# Altium project BCS1_REV2.2.PrjPcb (part 1 of 2)
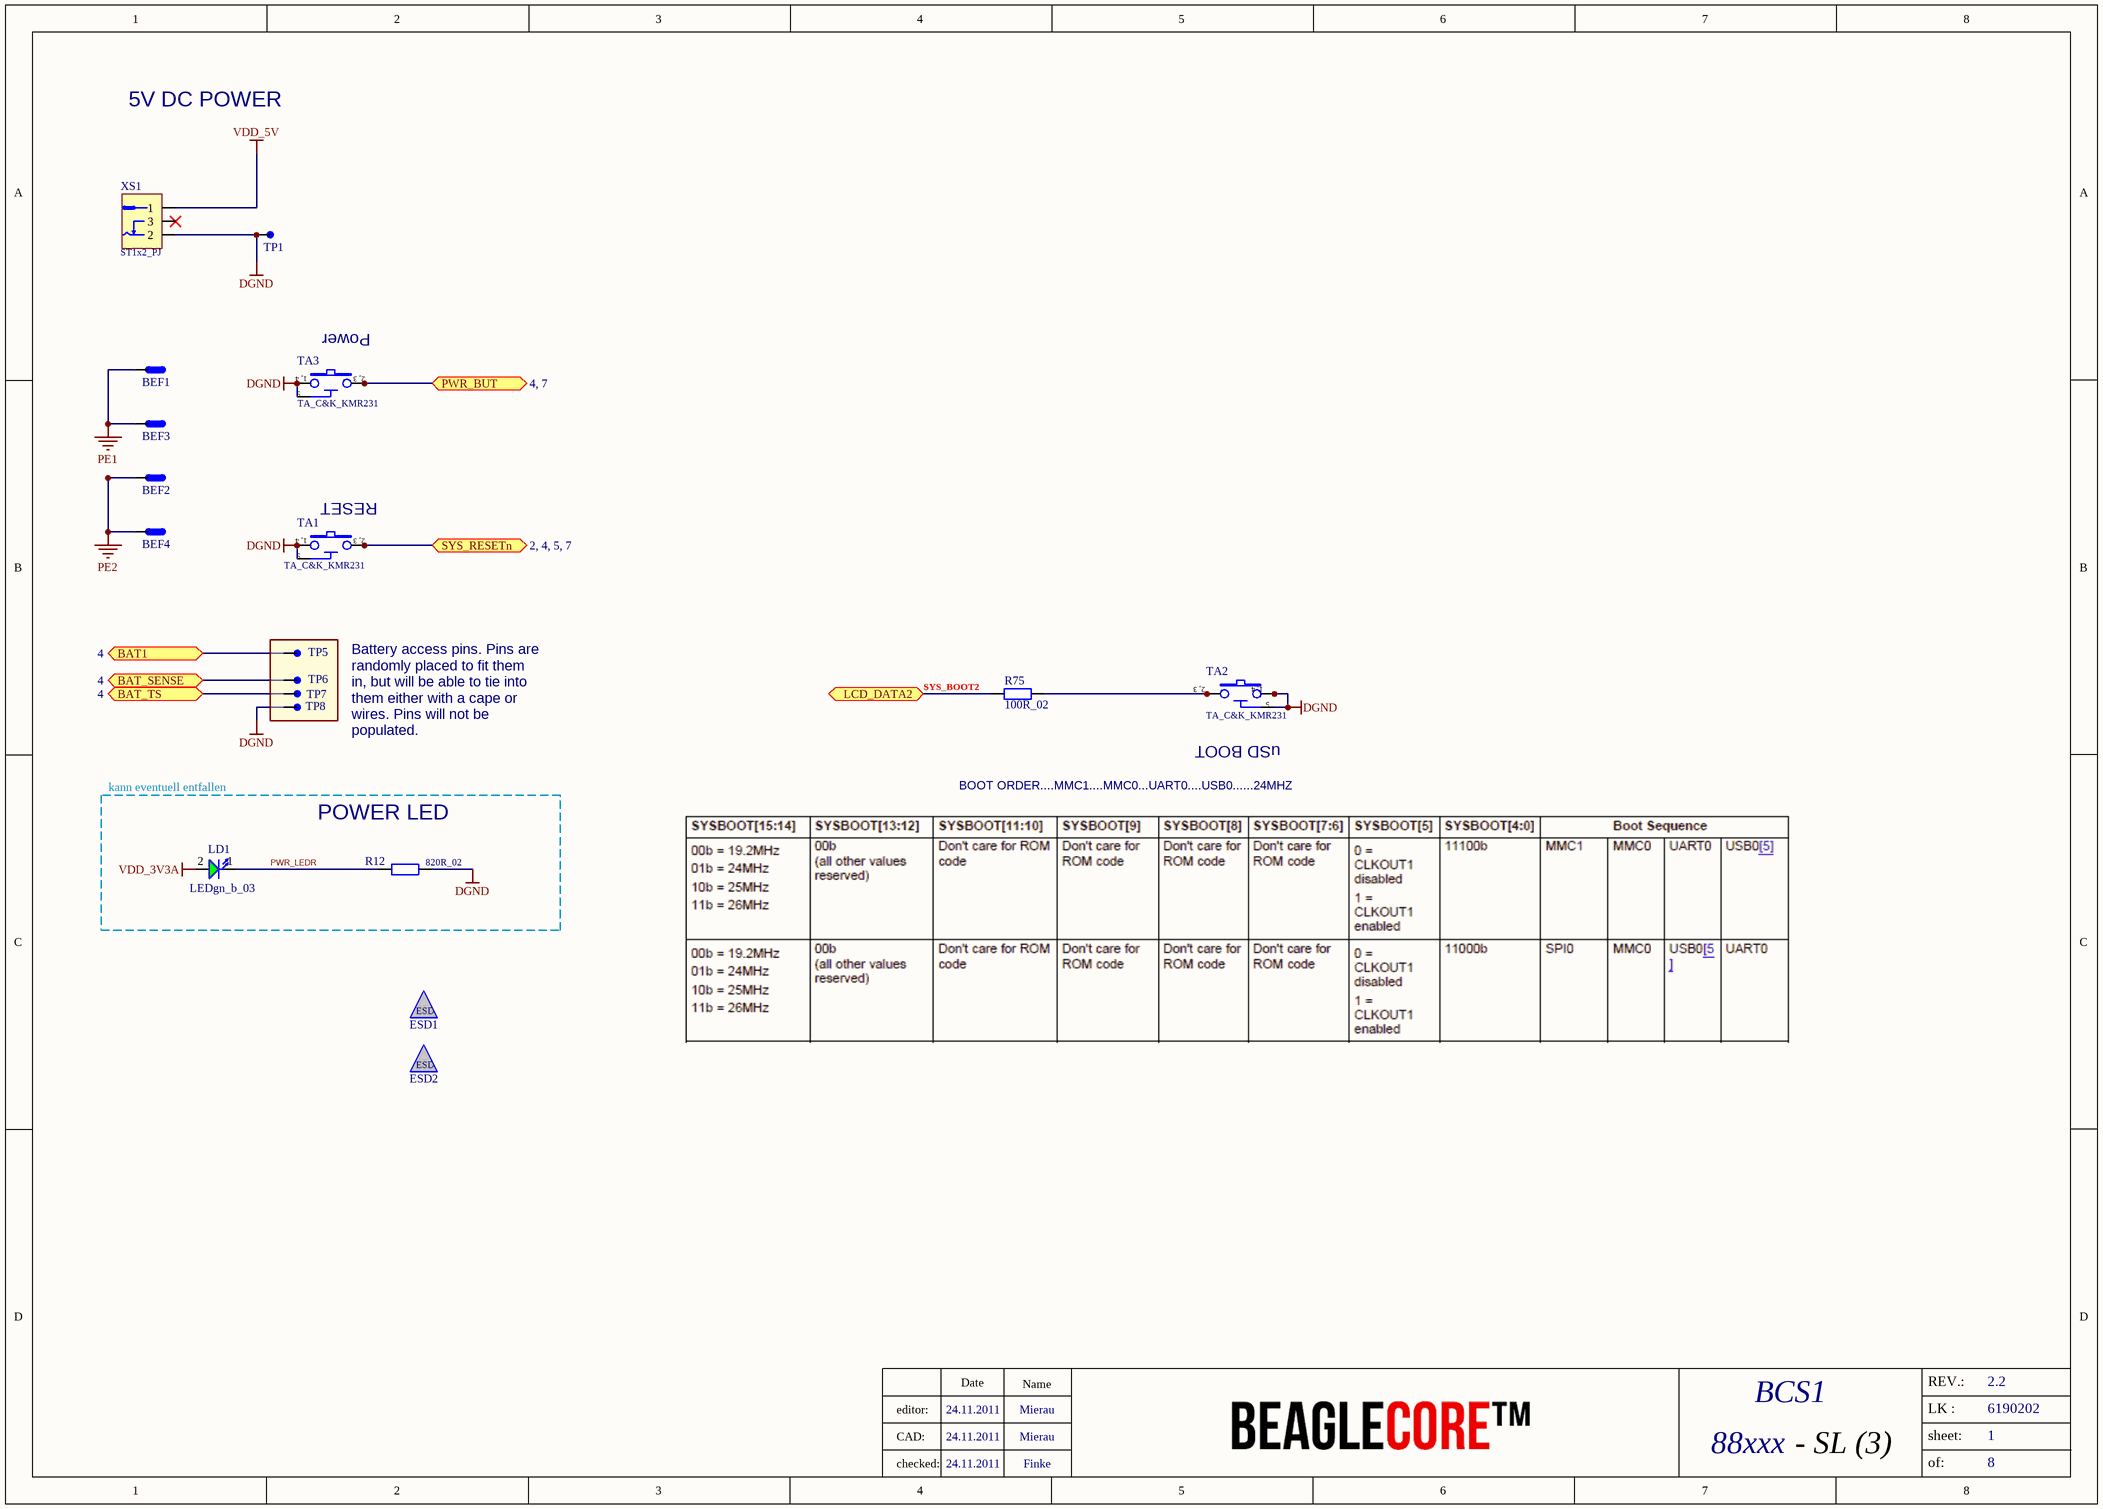
[diagram p0: P01_BCS1_Power BBCore.SchDoc]
IES_REV: 2.2; LKNummer: 6190202; ProjektName: BCS1; ProjektNummer: 88644
8 sheets, 201 parts. Net scope: global (net labels, ports and power ports of the same name join across sheets).
Board file: BCS1_REV2.2.PcbDoc
Sheets:
  P01_BCS1_Power BBCore.SchDoc
  P02_BCS1_JTAG, Clock, LED.SchDoc
  P03_BCS1_USB, Serial, uSD.SchDoc
  P04_BCS1_Core Connector.SchDoc
  P05_BCS1_Ethernet.SchDoc
  P06_BCS1_HDMI Framer.SchDoc
  P07_BCS1_Exp Conn.SchDoc
  P08_BCS1_Revision Page.SchDoc

## Sheet P01_BCS1_Power BBCore.SchDoc
size A3; Date: 24.11.2011; CheckedBy: Finke; Author: Mierau; DrawnBy: Mierau; SheetNumber: 1; SheetTotal: 8; Anlage: 78; Beschreibung: Qseven; Kunde: 56; ProjektName: BCS1; ProjektNummer: 88xxx; Ersatz_fuer: 12; ersetzt_durch: 34; LKNummer: 6190202; ID_Nummer: 90

### Parts
BEF1  BEF_3.2_4.45  [BEF_3.2_4.45]  (value not drawn)  (no BOM)
BEF2  BEF_3.2_4.45  [BEF_3.2_4.45]  (value not drawn)  (no BOM)
BEF3  BEF_3.2_4.45  [BEF_3.2_4.45]  (value not drawn)  (no BOM)
BEF4  BEF_3.2_4.45  [BEF_3.2_4.45]  (value not drawn)  (no BOM)
ESD1  ESD  [ESD_G]  (value not drawn)  (no BOM)
ESD2  ESD  [ESD_G]  (value not drawn)  (no BOM)
LD1  LEDgn_b_03  [CD1608-0603]
R12  820R_02  [CR1005-0402]
R75  100R_02  [CR1005-0402]
TA1  TA_C&K_KMR231  [TA_KMR2]
TA2  TA_C&K_KMR231  [TA_KMR2]
TA3  TA_C&K_KMR231  [TA_KMR2]
TP1  TP THT  [TP mit 0.8mm Bohrung]  (value not drawn)  (no BOM)
TP5  TP THT  [TP mit 0.8mm Bohrung]  (value not drawn)  (no BOM)
TP6  TP THT  [TP mit 0.8mm Bohrung]  (value not drawn)  (no BOM)
TP7  TP THT  [TP mit 0.8mm Bohrung]  (value not drawn)  (no BOM)
TP8  TP THT  [TP mit 0.8mm Bohrung]  (value not drawn)  (no BOM)
XS1  ST1x2_PJ  [ST1X2THT-2mm-DC_WA]

### Blocks framed on the sheet
POWER LED: LD1 R12

### Ports
BAT1 (see 4), BAT_SENSE (see 4), BAT_TS (see 4), LCD_DATA2, PWR_BUT (see 4, 7), SYS_RESETn (see 2, 4, 5, 7)

### Nets
DGND: R12.2 TA1.1 TA1.4 TA1.5 TA2.1 TA2.4 TA2.5 TA3.1 TA3.4 TA3.5 TP1.1(Pin) TP8.1(Pin) XS1.2
PE1: BEF1.1(Pin) BEF3.1(Pin)
PE2: BEF2.1(Pin) BEF4.1(Pin)
VDD_3V3A: LD1.2(A)
VDD_5V: XS1.1
BAT1: TP5.1(Pin) ; port BAT1
BAT_SENSE: TP6.1(Pin) ; port BAT_SENSE
BAT_TS: TP7.1(Pin) ; port BAT_TS
LCD_DATA2: R75.1 ; port LCD_DATA2
PWR_BUT: TA3.2 TA3.3 ; port PWR_BUT
PWR_LEDR: LD1.1(K) R12.1
SYS_RESETn: TA1.2 TA1.3 ; port SYS_RESETn
NetR75_2: R75.2 TA2.2 TA2.3

Not connected (* = marked no-connect by the designer): XS1 3*

### Notes on the sheet
- 5V DC POWER
- (near TA3) Power
- (near TA1) RESET
- (near R75) SYS_BOOT2
- Battery access pins. Pins are randomly placed to fit them in, but will be able to tie into them either with a cape or wires. Pins will not be populated.
- BOOT ORDER....MMC1....MMC0...UART0....USB0......24MHZ
- (near TA2) uSD BOOT
- kann eventuell entfallen
- Date
- Name
- REV.:
- editor:
- CAD:
- - SL (3)
- sheet:
- LK :
- checked:
- of:
- (in symbol TASTER_C&K_KMR231) 1, 4; 2, 3

### Library data of the parts
BEF1-BEF4 = A_BEF_3.2_4.45: Befestigungsbohrung D=3.2mm_4.45_Rand; Value: BEF_3.2_4.45
ESD1 ESD2 = A_ESD: ESD Symbol; Value: ESD
LD1 = LD_LEDgn_bright_03: Leuchtdiode bright grün 0603, RV(5mA)@3V3= 100OHM; Hersteller: Würth Elektronik; Bestellbezeichnung: 150060VS75000; Value: LEDgn_b_03
R12 = R820R_02: Resistor 0402; Value: 820R_02
R75 = R100R_02: Resistor 0402 1%; Value: 100R_02
TA1-TA3 = TASTER_C&K_KMR231: Taster smd 1pol mm pitch, 4.6x2.8mm case; Hersteller: C&K; Bestellbezeichnung: KMR231GLFS; Value: TA_C&K_KMR231
TP1 TP5-TP8 = TP1.6 mit Bohrung 0.8: Testpunkt rund mit Bohrung D=0.8mm; Value: TP THT
  TP5-TP8: Revision: *
XS1 = XST1X2_PJ_WA: DC-Power-Jack, 2mm Stift, 5A, THT,gew.; Hersteller: CUI; Bestellbezeichnung: PJ-002AH; Value: ST1x2_PJ

## Sheet P02_BCS1_JTAG, Clock, LED.SchDoc
size A3; Date: 24.11.2011; CheckedBy: Finke; Author: Mierau; DrawnBy: Mierau; SheetNumber: 2; SheetTotal: 8; Anlage: 78; Beschreibung: Qseven; Kunde: 56; ProjektName: BCS1; ProjektNummer: 88xxx; Ersatz_fuer: 12; ersetzt_durch: 34; LKNummer: 6190202; ID_Nummer: 90
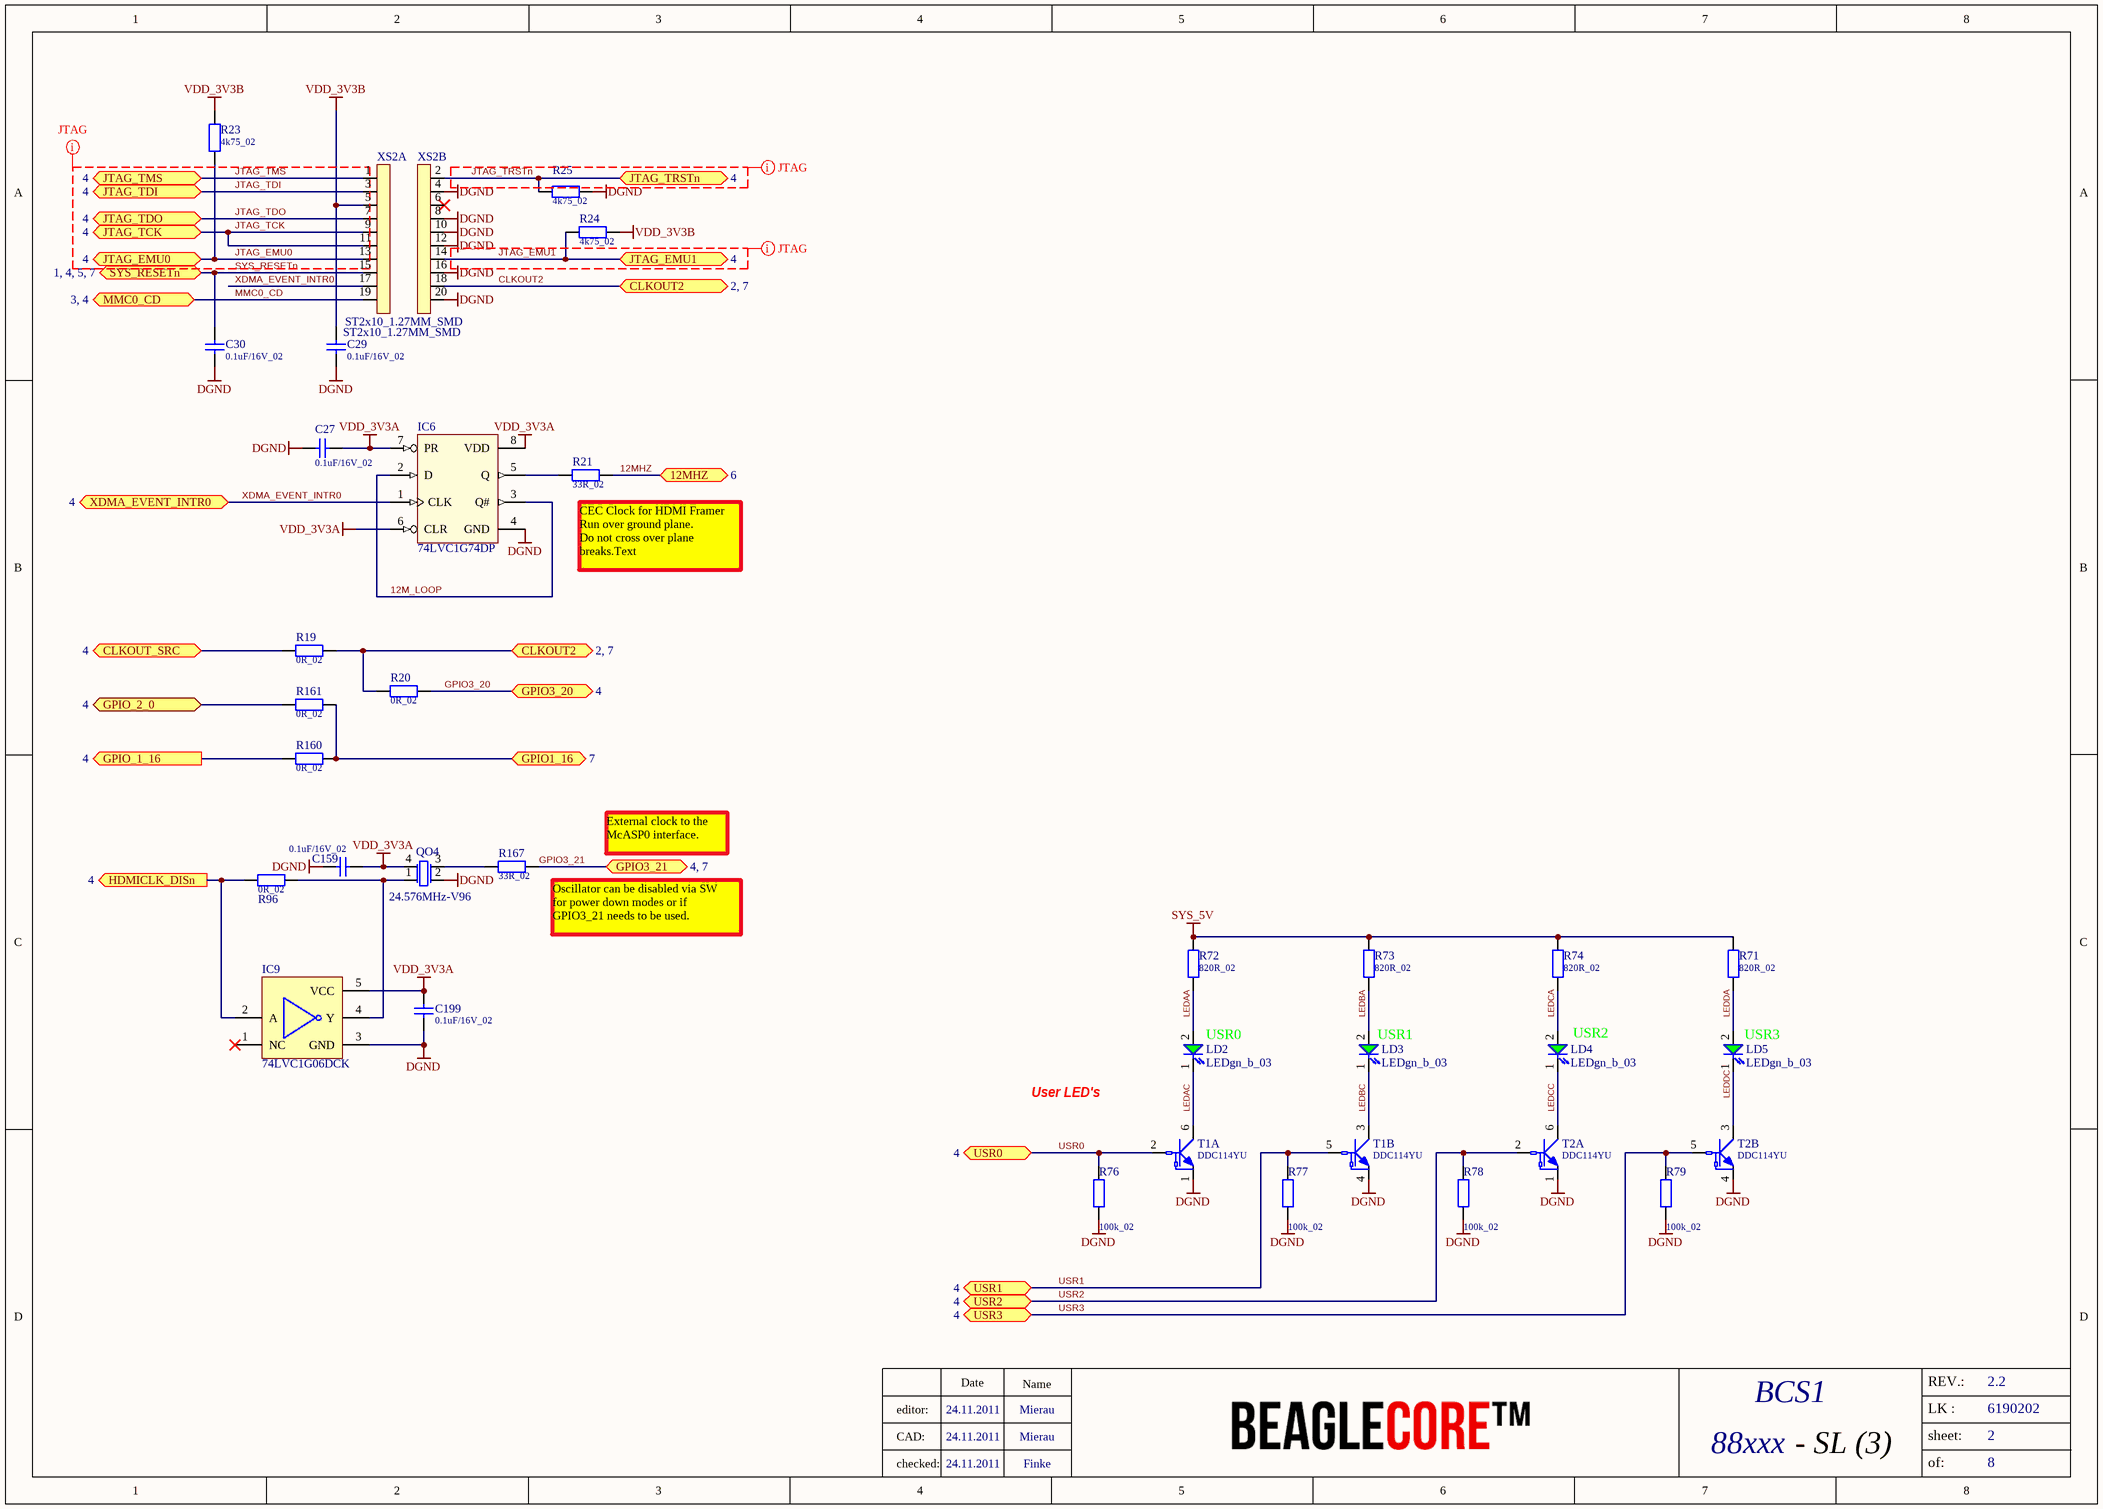
[diagram p1: P02_BCS1_JTAG, Clock, LED.SchDoc]

### Parts
C27  0.1uF/16V_02  [CC1005-0402]
C29  0.1uF/16V_02  [CC1005-0402]
C30  0.1uF/16V_02  [CC1005-0402]
C159  0.1uF/16V_02  [CC1005-0402]
C199  0.1uF/16V_02  [CC1005-0402]
IC6  74LVC1G74DP  [TSSOP8 - 3x3]
IC9  74LVC1G06DCK  [SOT353]
LD2  LEDgn_b_03  [CD1608-0603]
LD3  LEDgn_b_03  [CD1608-0603]
LD4  LEDgn_b_03  [CD1608-0603]
LD5  LEDgn_b_03  [CD1608-0603]
QO4  24.576MHz-V96  [QUARZ KXO-V96]
R19  0R_02  [CR1005-0402]
R20  0R_02  [CR1005-0402]
R21  33R_02  [CR1005-0402]
R23  4k75_02  [CR1005-0402]
R24  4k75_02  [CR1005-0402]
R25  4k75_02  [CR1005-0402]
R71  820R_02  [CR1005-0402]
R72  820R_02  [CR1005-0402]
R73  820R_02  [CR1005-0402]
R74  820R_02  [CR1005-0402]
R76  100k_02  [CR1005-0402]
R77  100k_02  [CR1005-0402]
R78  100k_02  [CR1005-0402]
R79  100k_02  [CR1005-0402]
R96  0R_02  [CR1005-0402]
R160  0R_02  [CR1005-0402]
R161  0R_02  [CR1005-0402]
R167  33R_02  [CR1005-0402]
T1  DDC114YU  [SOT363]  (parts A,B of 2)
T2  DDC114YU  [SOT363]  (parts A,B of 2)
XS2  ST2x10_1.27MM_SMD  [ST2X10SMD-1.27_SAMTEC]  (parts A,B of 2)

### Ports
12MHZ (see 6), CLKOUT2 (see 2, 7), CLKOUT_SRC (bidir, see 4), GPIO1_16 (see 7), GPIO3_20 (see 4), GPIO3_21 (see 4, 7), GPIO_1_16 (out, see 4), GPIO_2_0 (bidir, see 4), HDMICLK_DISn (out, see 4), JTAG_EMU0 (see 4), JTAG_EMU1 (see 4), JTAG_TCK (see 4), JTAG_TDI (see 4), JTAG_TDO (see 4), JTAG_TMS (see 4), JTAG_TRSTn (see 4), MMC0_CD (see 3, 4), SYS_RESETn (see 1, 4, 5, 7), USR0 (see 4), USR1 (see 4), USR2 (see 4), USR3 (see 4), XDMA_EVENT_INTR0 (bidir, see 4)

### Nets
DGND: C27.2 C29.1 C30.1 C159.1 C199.1 IC6.4(GND) IC9.3(GND) QO4.2(GND) R25.2 R76.1 R77.1 R78.1 R79.1 T1.1(EMITTER1) T1.4(EMITTER2) T2.1(EMITTER1) T2.4(EMITTER2) XS2.4 XS2.8 XS2.10 XS2.12 XS2.16 XS2.20
SYS_5V: R71.1 R72.1 R73.1 R74.1
VDD_3V3A: C27.1 C159.2 C199.2 IC6.6(CLR) IC6.7(PR) IC6.8(VDD) IC9.5(VCC) QO4.4(VDD)
VDD_3V3B: C29.2 R23.1 R24.1 XS2.5
12M_LOOP: IC6.2(D) IC6.3(Q#)
12MHZ: R21.2 ; port 12MHZ
CLKOUT2: R19.2 R20.1 XS2.18 ; port CLKOUT2
CLKOUT_SRC: R19.1 ; port CLKOUT_SRC
GPIO1_16: R160.2 R161.2 ; port GPIO1_16
GPIO3_20: R20.2 ; port GPIO3_20
GPIO3_21: R167.2 ; port GPIO3_21
GPIO_1_16: R160.1 ; port GPIO_1_16
GPIO_2_0: R161.1 ; port GPIO_2_0
HDMICLK_DISn: IC9.2(A) R96.1 ; port HDMICLK_DISn
JTAG_EMU0: R23.2 XS2.13 ; port JTAG_EMU0
JTAG_EMU1: R24.2 XS2.14 ; port JTAG_EMU1
JTAG_TCK: XS2.9 XS2.11 ; port JTAG_TCK
JTAG_TDI: XS2.3 ; port JTAG_TDI
JTAG_TDO: XS2.7 ; port JTAG_TDO
JTAG_TMS: XS2.1 ; port JTAG_TMS
JTAG_TRSTn: R25.1 XS2.2 ; port JTAG_TRSTn
LEDAA: LD2.2(A) R72.2
LEDAC: LD2.1(K) T1.6(COLLECTOR1)
LEDBA: LD3.2(A) R73.2
LEDBC: LD3.1(K) T1.3(COLLECTOR2)
LEDCA: LD4.2(A) R74.2
LEDCC: LD4.1(K) T2.6(COLLECTOR1)
LEDDA: LD5.2(A) R71.2
LEDDC: LD5.1(K) T2.3(COLLECTOR2)
MMC0_CD: XS2.19 ; port MMC0_CD
SYS_RESETn: C30.2 XS2.15 ; port SYS_RESETn
USR0: R76.2 T1.2(BASE1) ; port USR0
USR1: R77.2 T1.5(BASE2) ; port USR1
USR2: R78.2 T2.2(BASE1) ; port USR2
USR3: R79.2 T2.5(BASE2) ; port USR3
XDMA_EVENT_INTR0: IC6.1(CLK) XS2.17 ; port XDMA_EVENT_INTR0
NetIC6_5: IC6.5(Q) R21.1
NetIC9_4: IC9.4(Y) QO4.1(EN#) R96.2
NetQO4_3: QO4.3(OUTPUT) R167.1

Not connected (* = marked no-connect by the designer): IC9 1(NC)*; XS2 6*

### Layout directives
net class JTAG: JTAG_EMU0, JTAG_EMU1, JTAG_TCK, JTAG_TDI, JTAG_TDO, JTAG_TMS, JTAG_TRSTn

### Notes on the sheet
- (near R21) CEC Clock for HDMI Framer
  Run over ground plane.
  Do not cross over plane
  breaks.Text
- External clock to the
  McASP0 interface.
- (near R167) Oscillator can be disabled via SW
  for power down modes or if
  GPIO3_21 needs to be used.
- (near LD2) USR0
- (near LD3) USR1
- (near LD4) USR2
- (near LD5) USR3
- User LED's
- Date
- Name
- REV.:
- editor:
- CAD:
- - SL (3)
- sheet:
- LK :
- checked:
- of:

### Library data of the parts
C27 C29 C30 C159 C199 = C0.1uF/16V_02: Capacitor 0402 16V Y5V; Value: 0.1uF/16V_02
IC6 = IC74LVC1G74DP: Dual D-Type Positive-Edge-Triggered Flip-Flop with Set and Reset; Hersteller: NXP; Bestellbezeichnung: 74LVC1G74DP; Value: 74LVC1G74DP
IC9 = IC74LVC1G06DCK: Single Inverter Buffer/Driver With Open-Drain Output; Hersteller: TI; Bestellbezeichnung: 74LVC1G06DCK; Value: 74LVC1G06DCK
LD2-LD5 = LD_LEDgn_bright_03: as LD1 on sheet P01_BCS1_Power BBCore; Value: LEDgn_b_03
QO4 = QO24.576MHz_V96: Quarz Oszillator 24.576MHz; KXO-V96; Hersteller: Geyer; Bestellbezeichnung: KXO-V96 24.576MHz; Value: 24.576MHz-V96
R19 R20 R96 R160 R161 = R0R_02: Resistor 0402; Value: 0R_02
R21 R167 = R33R_02: Resistor 0402; Value: 33R_02
R23-R25 = R4k75_02: Resistor 0402; Value: 4k75_02
R71-R74 = R820R_02: Resistor 0402; Value: 820R_02
R76-R79 = R100k_02: Resistor 0402; Value: 100k_02
T1 T2 = TDDC114YU: 2 fach NPN m Widerständen Vceo=40V, Ic=0.1A; Hersteller: Rohm; Bestellbezeichnung: DDC114YU; Value: DDC114YU
XS2 = XST2X10_1.27MM_SMD_SAM: Stiftleiste 20polig, 1.27mm pitch, Samtec; Bestellbezeichnung: FTR-110-03-G-D-06; Hersteller: Samtec; Value: ST2x10_1.27MM_SMD

## Sheet P03_BCS1_USB, Serial, uSD.SchDoc
size A3; Date: 24.11.2011; CheckedBy: Finke; Author: Mierau; DrawnBy: Mierau; SheetNumber: 3; SheetTotal: 8; Anlage: 78; Beschreibung: Qseven; Kunde: 56; ProjektName: BCS1; ProjektNummer: 88xxx; Ersatz_fuer: 12; ersetzt_durch: 34; LKNummer: 6190202; ID_Nummer: 90
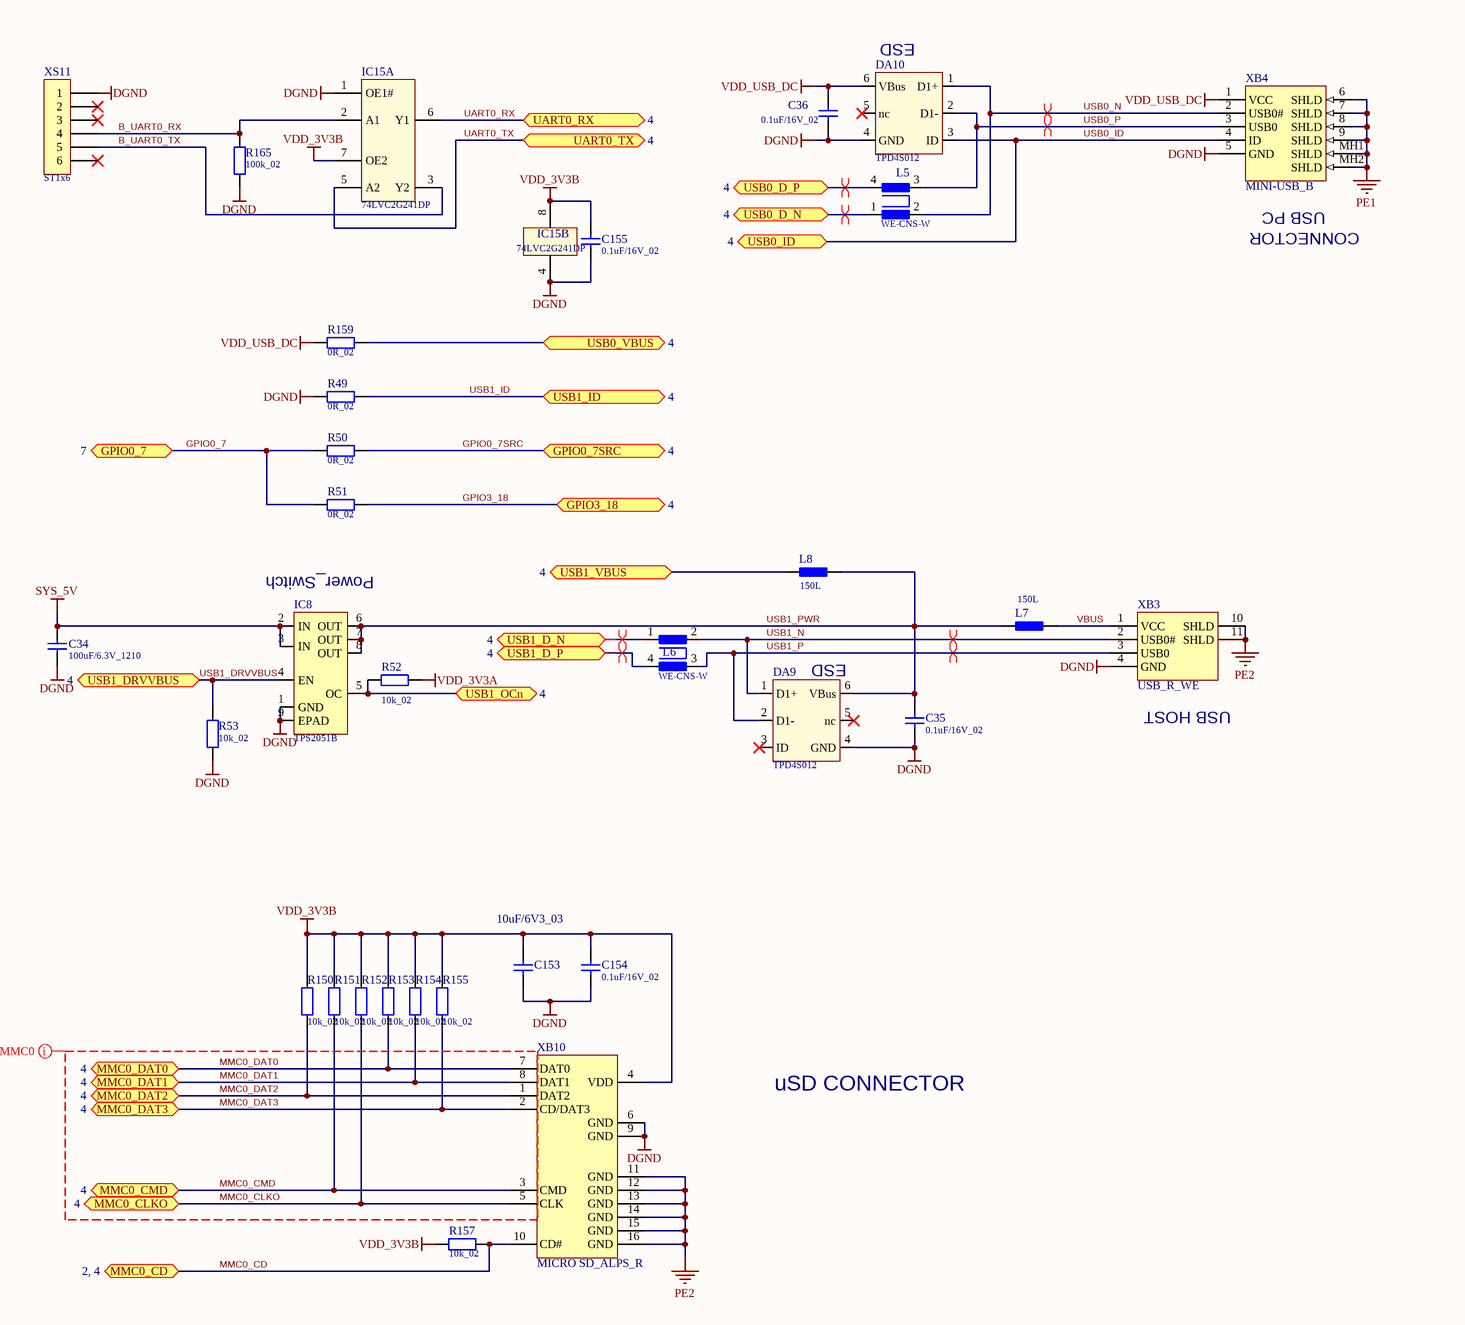
[diagram p2: P03_BCS1_USB, Serial, uSD.SchDoc]

### Parts
C34  100uF/6.3V_1210  [CC3225-1210]
C35  0.1uF/16V_02  [CC1005-0402]
C36  0.1uF/16V_02  [CC1005-0402]
C153  10uF/6V3_03  [CC1608-0603]
C154  0.1uF/16V_02  [CC1005-0402]
C155  0.1uF/16V_02  [CC1005-0402]
DA9  TPD4S012  [SON6]
DA10  TPD4S012  [SON6]
IC8  TPS2051B  [DGN-MSOP8+1]
IC15  74LVC2G241DP  [TSSOP8 - 3x3]  (parts A,B of 2)
L5  WE-CNS-W  [WE-CNS_W - 0805]
L6  WE-CNS-W  [WE-CNS_W - 0805]
L7  150L  [CR2012-0805]
L8  150L  [CR2012-0805]
R49  0R_02  [CR1005-0402]
R50  0R_02  [CR1005-0402]
R51  0R_02  [CR1005-0402]
R52  10k_02  [CR1005-0402]
R53  10k_02  [CR1005-0402]
R150  10k_02  [CR1005-0402]
R151  10k_02  [CR1005-0402]
R152  10k_02  [CR1005-0402]
R153  10k_02  [CR1005-0402]
R154  10k_02  [CR1005-0402]
R155  10k_02  [CR1005-0402]
R157  10k_02  [CR1005-0402]
R159  0R_02  [CR1005-0402]
R165  100k_02  [CR1005-0402]
XB3  USB_R_WE  [61400416021]
XB4  MINI-USB_B  [USB-MINI-B]
XB10  MICRO SD_ALPS_R  [Micro-SD-Card-Conn-ALPS- Reverse Mount]
XS11  ST1x6  [ST6]

### Ports
GPIO0_7 (see 7), GPIO0_7SRC (bidir, see 4), GPIO3_18 (bidir, see 4), MMC0_CD (see 2, 4), MMC0_CLKO (see 4), MMC0_CMD (see 4), MMC0_DAT0 (see 4), MMC0_DAT1 (see 4), MMC0_DAT2 (see 4), MMC0_DAT3 (see 4), UART0_RX (see 4), UART0_TX (see 4), USB0_D_N (bidir, see 4), USB0_D_P (bidir, see 4), USB0_ID (see 4), USB0_VBUS (see 4), USB1_D_N (bidir, see 4), USB1_D_P (bidir, see 4), USB1_DRVVBUS (see 4), USB1_ID (see 4), USB1_OCn (see 4), USB1_VBUS (see 4)

### Nets
DGND: C34.1 C35.2 C36.2 C153.1 C154.1 C155.2 DA9.4(GND) DA10.4(GND) IC8.1(GND) IC8.9(EPAD) IC15.1(OE1#) IC15.4(GND) R49.1 R53.1 R165.1 XB3.4(GND) XB4.5(GND) XB10.6(GND) XB10.9(GND) XS11.1
PE1: XB4.6(SHLD) XB4.7(SHLD) XB4.8(SHLD) XB4.9(SHLD) XB4.MH1(SHLD) XB4.MH2(SHLD)
PE2: XB3.10(SHLD) XB3.11(SHLD) XB10.11(GND) XB10.12(GND) XB10.13(GND) XB10.14(GND) XB10.15(GND) XB10.16(GND)
SYS_5V: C34.2 IC8.2(IN) IC8.3(IN)
VDD_3V3A: R52.2
VDD_3V3B: C153.2 C154.2 C155.1 IC15.7(OE2) IC15.8(VDD) R150.1 R151.1 R152.1 R153.1 R154.1 R155.1 R157.1 XB10.4(VDD)
VDD_USB_DC: C36.1 DA10.6(VBus) R159.1 XB4.1(VCC)
B_UART0_RX: IC15.2(A1) R165.2 XS11.4
B_UART0_TX: IC15.3(Y2) XS11.5
GPIO0_7: R50.1 R51.1 ; port GPIO0_7
GPIO0_7SRC: R50.2 ; port GPIO0_7SRC
GPIO3_18: R51.2 ; port GPIO3_18
MMC0_CD: R157.2 XB10.10(CD#) ; port MMC0_CD
MMC0_CLKO: R152.2 XB10.5(CLK) ; port MMC0_CLKO
MMC0_CMD: R151.2 XB10.3(CMD) ; port MMC0_CMD
MMC0_DAT0: R153.2 XB10.7(DAT0) ; port MMC0_DAT0
MMC0_DAT1: R154.2 XB10.8(DAT1) ; port MMC0_DAT1
MMC0_DAT2: R150.2 XB10.1(DAT2) ; port MMC0_DAT2
MMC0_DAT3: R155.2 XB10.2(CD/DAT3) ; port MMC0_DAT3
UART0_RX: IC15.6(Y1) ; port UART0_RX
UART0_TX: IC15.5(A2) ; port UART0_TX
USB0_D_N: L5.1 ; port USB0_D_N
USB0_D_P: L5.4 ; port USB0_D_P
USB0_ID: DA10.3(ID) XB4.4(ID) ; port USB0_ID
USB0_N: DA10.1(D1+) L5.2 XB4.2(USB0#)
USB0_P: DA10.2(D1-) L5.3 XB4.3(USB0)
USB0_VBUS: R159.2 ; port USB0_VBUS
USB1_D_N: L6.1 ; port USB1_D_N
USB1_D_P: L6.4 ; port USB1_D_P
USB1_DRVVBUS: IC8.4(EN) R53.2 ; port USB1_DRVVBUS
USB1_ID: R49.2 ; port USB1_ID
USB1_N: DA9.1(D1+) L6.2 XB3.2(USB0#)
USB1_OCn: IC8.5(OC) R52.1 ; port USB1_OCn
USB1_P: DA9.2(D1-) L6.3 XB3.3(USB0)
USB1_PWR: C35.1 DA9.6(VBus) IC8.6(OUT) IC8.7(OUT) IC8.8(OUT) L7.1 L8.2
USB1_VBUS: L8.1 ; port USB1_VBUS
VBUS: L7.2 XB3.1(VCC)

Not connected (* = marked no-connect by the designer): DA9 3(ID)* 5(nc)*; DA10 5(nc)*; XS11 2* 3* 6*

### Layout directives
differential pair: USB0_D_N, USB0_D_P, USB0_N, USB0_P, USB1_D_N, USB1_D_P, USB1_N, USB1_P
net class MMC0: MMC0_CLKO, MMC0_CMD, MMC0_DAT0, MMC0_DAT1, MMC0_DAT2, MMC0_DAT3

### Notes on the sheet
- (near DA10) ESD
- (near XB4) USB PC
- CONNECTOR
- (near IC8) Power_Switch
- (near DA9) ESD
- (near XB3) USB HOST
- uSD CONNECTOR
- Date
- Name
- REV.:
- editor:
- CAD:
- - SL (3)
- sheet:
- LK :
- checked:
- of:

### Library data of the parts
C34 = C100uF/6.3V_10: Capacitor 1210; 6.3V; Hersteller: Murata; Bestellbezeichnung: GRM32ER60J107ME20; Value: 100uF/6.3V_1210
C35 C36 C154 C155 = C0.1uF/16V_02: Capacitor 0402 16V Y5V; Value: 0.1uF/16V_02
C153 = C10uF/6V3_03: Capacitor 0603 6V3; 10%, X5R; Value: 10uF/6V3_03
DA9 DA10 = DATPD4S012: Diode Array TVS,  for USB2.0 TypB; 4fach; Hersteller: TI; Bestellbezeichnung: TPD4S012; Value: TPD4S012
IC8 = ICTPS2051B: Current-Limited PowerSwitch; Hersteller: ti; Bestellbezeichnung: TPS2051BDGNR; Value: TPS2051B
IC15 = IC74LVC2G241DP: dual buffer/line driver; 3-state, 5V-tolerant; Hersteller: NXP; Bestellbezeichnung: 74LVC2G241DP; Value: 74LVC2G241DP
L5 L6 = LWE-CNS FILTER: Stromkomp. Datenleitungsfilter WE-CNS-W, 90 Ohm; Hersteller: Würth Elektronik; Bestellbezeichnung: 744231091; Value: WE-CNS-W
L7 L8 = L150 Ohm Ferrite: Inductor 120 Ohm Ferrite 0805, 800mA; Hersteller: Laird-Signal Integrity Products; Bestellbezeichnung: LI0805H151R-10; Value: 150L
R49-R51 R159 = R0R_02: Resistor 0402; Value: 0R_02
R52 R53 R150-R155 R157 = R10k_02: Resistor 0402; Value: 10k_02
R165 = R100k_02: Resistor 0402; Value: 100k_02
XB3 = XBUSB_R_WE: USB einfach RA Type A; Hersteller: Würth; Bestellbezeichnung: 61400416021; Value: USB_R_WE
XB4 = XBUSB_Mini-B: USB MINI Typ B einfach 5pol.; Hersteller: Molex; Bestellbezeichnung: 0513870530; Value: MINI-USB_B
XB10 = XBMICRO_SD_ALPS_R: MICRO SD Memory card connector push/push  reverse mount ALPS (SCHA5B0200); Hersteller: ALPS; Bestellbezeichnung: SCHA5B0200; Value: MICRO SD_ALPS_R
XS11 = XST1X6: Modul-Stiftleiste 2.54mm pitch einreihig, 6pol.; Value: ST1x6

## Sheet P04_BCS1_Core Connector.SchDoc
size A3; Date: 24.11.2011; CheckedBy: Finke; Author: Mierau; DrawnBy: Mierau; SheetNumber: 4; SheetTotal: 8; Anlage: 78; Beschreibung: Qseven; Kunde: 56; ProjektName: BCS1; ProjektNummer: 88xxx; Ersatz_fuer: 12; ersetzt_durch: 34; LKNummer: 6190202; ID_Nummer: 90
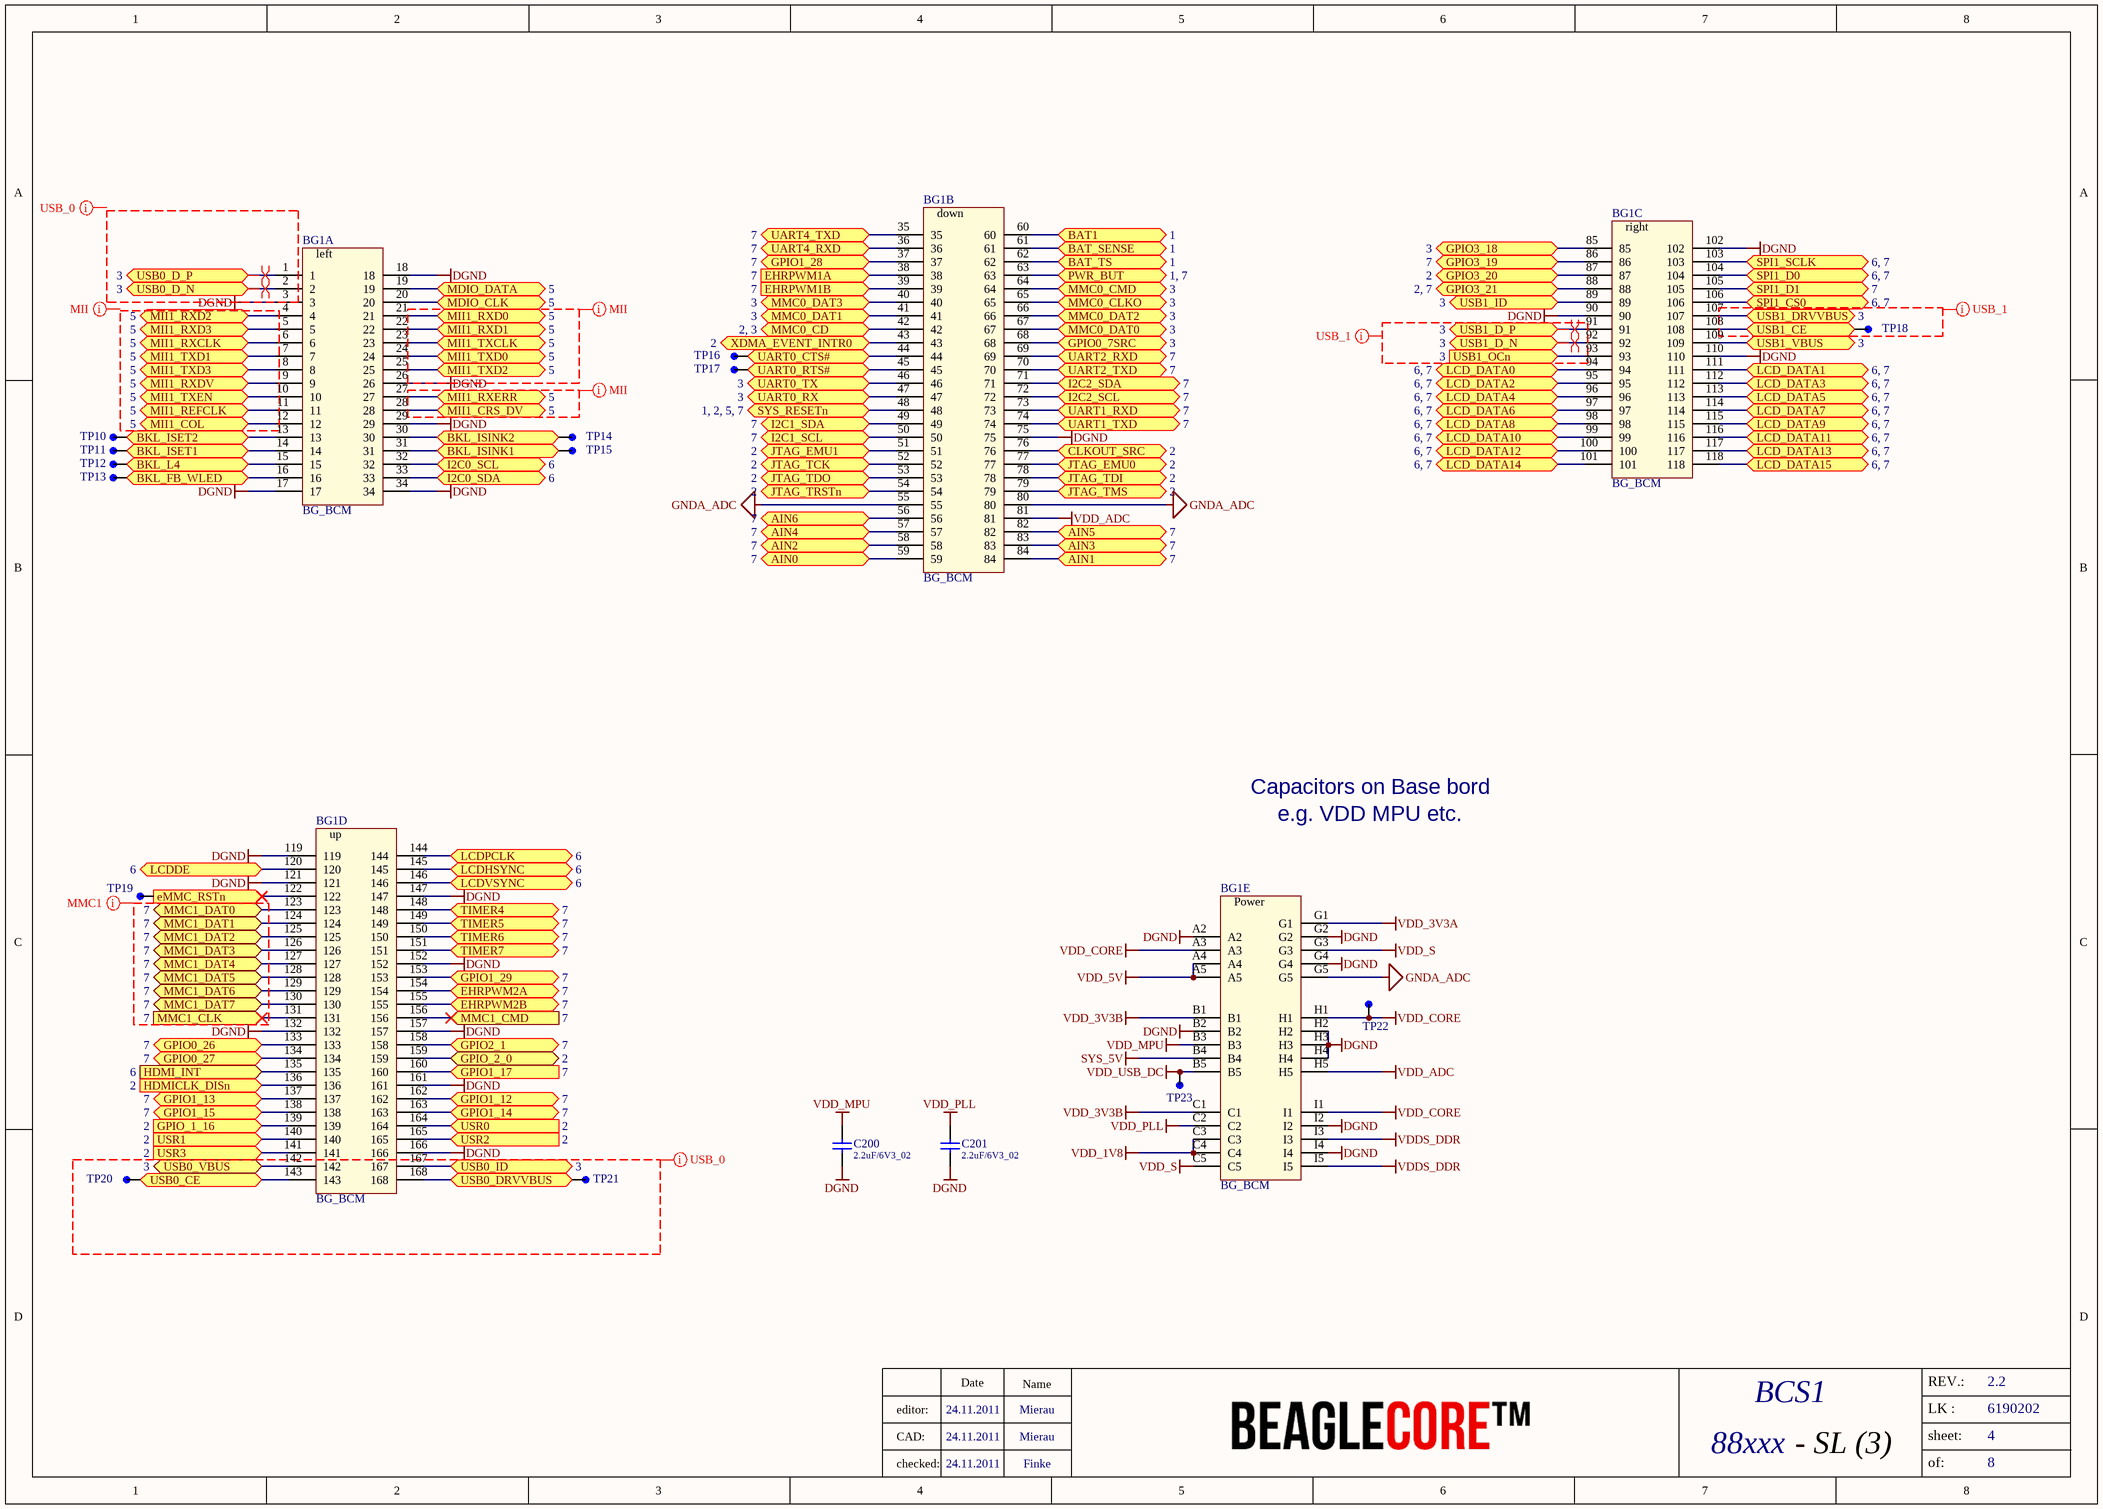
[diagram p3: P04_BCS1_Core Connector.SchDoc]

### Parts
BG1  BG_BCM  [BG_BCM]  (parts A,B,C,D,E of 5)  (no BOM)
C200  2.2uF/6V3_02  [CC1005-0402]
C201  2.2uF/6V3_02  [CC1005-0402]
TP10  TP THT  [TP mit 0.8mm Bohrung]  (value not drawn)  (no BOM)
TP11  TP THT  [TP mit 0.8mm Bohrung]  (value not drawn)  (no BOM)
TP12  TP THT  [TP mit 0.8mm Bohrung]  (value not drawn)  (no BOM)
TP13  TP THT  [TP mit 0.8mm Bohrung]  (value not drawn)  (no BOM)
TP14  TP THT  [TP mit 0.8mm Bohrung]  (value not drawn)  (no BOM)
TP15  TP THT  [TP mit 0.8mm Bohrung]  (value not drawn)  (no BOM)
TP16  TP THT  [TP mit 0.8mm Bohrung]  (value not drawn)  (no BOM)
TP17  TP THT  [TP mit 0.8mm Bohrung]  (value not drawn)  (no BOM)
TP18  TP THT  [TP mit 0.8mm Bohrung]  (value not drawn)  (no BOM)
TP19  TP THT  [TP mit 0.8mm Bohrung]  (value not drawn)  (no BOM)
TP20  TP THT  [TP mit 0.8mm Bohrung]  (value not drawn)  (no BOM)
TP21  TP THT  [TP mit 0.8mm Bohrung]  (value not drawn)  (no BOM)
TP22  TP THT  [TP mit 0.8mm Bohrung]  (value not drawn)  (no BOM)
TP23  TP THT  [TP mit 0.8mm Bohrung]  (value not drawn)  (no BOM)

### Ports
AIN0 (see 7), AIN1 (see 7), AIN2 (see 7), AIN3 (see 7), AIN4 (see 7), AIN5 (see 7), AIN6 (see 7), BAT1 (see 1), BAT_SENSE (see 1), BAT_TS (see 1), BKL_FB_WLED (bidir), BKL_ISET1 (bidir), BKL_ISET2 (bidir), BKL_ISINK1 (bidir), BKL_ISINK2 (bidir), BKL_L4 (bidir), CLKOUT_SRC (bidir, see 2), EHRPWM1A (in, see 7), EHRPWM1B (in, see 7), EHRPWM2A (bidir, see 7), EHRPWM2B (bidir, see 7), eMMC_RSTn (in), GPIO0_7SRC (bidir, see 3), GPIO0_26 (bidir, see 7), GPIO0_27 (bidir, see 7), GPIO1_12 (bidir, see 7), GPIO1_13 (bidir, see 7), GPIO1_14 (bidir, see 7), GPIO1_15 (bidir, see 7), GPIO1_17 (in, see 7), GPIO1_28 (bidir, see 7), GPIO1_29 (bidir, see 7), GPIO2_1 (bidir, see 7), GPIO3_18 (bidir, see 3), GPIO3_19 (bidir, see 7), GPIO3_20 (bidir, see 2), GPIO3_21 (bidir, see 2, 7), GPIO_1_16 (in, see 2), GPIO_2_0 (bidir, see 2), HDMI_INT (in, see 6), HDMICLK_DISn (in, see 2), I2C0_SCL (bidir, see 6), I2C0_SDA (bidir, see 6), I2C1_SCL (bidir, see 7), I2C1_SDA (bidir, see 7), I2C2_SCL (bidir, see 7), I2C2_SDA (bidir, see 7), JTAG_EMU0 (see 2), JTAG_EMU1 (see 2), JTAG_TCK (see 2), JTAG_TDI (see 2), JTAG_TDO (see 2), JTAG_TMS (see 2), JTAG_TRSTn (see 2), LCD_DATA0 (bidir, see 6, 7), LCD_DATA1 (bidir, see 6, 7), LCD_DATA2 (bidir, see 6, 7), LCD_DATA3 (bidir, see 6, 7), LCD_DATA4 (bidir, see 6, 7), LCD_DATA5 (bidir, see 6, 7), LCD_DATA6 (bidir, see 6, 7), LCD_DATA7 (bidir, see 6, 7), LCD_DATA8 (bidir, see 6, 7), LCD_DATA9 (bidir, see 6, 7), LCD_DATA10 (bidir, see 6, 7), LCD_DATA11 (bidir, see 6, 7), LCD_DATA12 (bidir, see 6, 7), LCD_DATA13 (bidir, see 6, 7), LCD_DATA14 (bidir, see 6, 7), LCD_DATA15 (bidir, see 6, 7), LCDDE (bidir, see 6), LCDHSYNC (bidir, see 6), LCDPCLK (bidir, see 6), LCDVSYNC (bidir, see 6), MDIO_CLK (bidir, see 5), MDIO_DATA (bidir, see 5), MII1_COL (bidir, see 5), MII1_CRS_DV (bidir, see 5), MII1_REFCLK (bidir, see 5), MII1_RXCLK (bidir, see 5), MII1_RXD0 (bidir, see 5), MII1_RXD1 (bidir, see 5), MII1_RXD2 (bidir, see 5), MII1_RXD3 (bidir, see 5), MII1_RXDV (bidir, see 5), MII1_RXERR (bidir, see 5), MII1_TXCLK (bidir, see 5), MII1_TXD0 (bidir, see 5), MII1_TXD1 (bidir, see 5), MII1_TXD2 (bidir, see 5), MII1_TXD3 (bidir, see 5), MII1_TXEN (bidir, see 5), MMC0_CD (bidir, see 2, 3), MMC0_CLKO (bidir, see 3), MMC0_CMD (bidir, see 3), MMC0_DAT0 (bidir, see 3), MMC0_DAT1 (bidir, see 3), MMC0_DAT2 (bidir, see 3), MMC0_DAT3 (bidir, see 3), MMC1_CLK (in, see 7), MMC1_CMD (in, see 7), MMC1_DAT0 (bidir, see 7), MMC1_DAT1 (bidir, see 7), MMC1_DAT2 (bidir, see 7), MMC1_DAT3 (bidir, see 7), MMC1_DAT4 (bidir, see 7), MMC1_DAT5 (bidir, see 7), MMC1_DAT6 (bidir, see 7), MMC1_DAT7 (bidir, see 7), PWR_BUT (see 1, 7), SPI1_CS0 (bidir, see 6, 7), SPI1_D0 (bidir, see 6, 7), SPI1_D1 (bidir, see 7), SPI1_SCLK (bidir, see 6, 7), SYS_RESETn (bidir, see 1, 2, 5, 7), TIMER4 (bidir, see 7), TIMER5 (bidir, see 7), TIMER6 (bidir, see 7), TIMER7 (bidir, see 7), UART0_CTS# (bidir), UART0_RTS# (bidir), UART0_RX (see 3), UART0_TX (bidir, see 3), UART1_RXD (bidir, see 7), UART1_TXD (bidir, see 7), UART2_RXD (bidir, see 7), UART2_TXD (bidir, see 7), UART4_RXD (bidir, see 7), UART4_TXD (see 7), USB0_CE, USB0_D_N (bidir, see 3), USB0_D_P (bidir, see 3), USB0_DRVVBUS, USB0_ID (see 3), USB0_VBUS (see 3), USB1_CE, USB1_D_N (bidir, see 3), USB1_D_P (bidir, see 3), USB1_DRVVBUS (see 3), USB1_ID (see 3), USB1_OCn (in, see 3), USB1_VBUS (see 3), USR0 (in, see 2), USR1 (in, see 2), USR2 (in, see 2), USR3 (in, see 2), XDMA_EVENT_INTR0 (bidir, see 2)

### Nets
DGND: BG1.3 BG1.17 BG1.18 BG1.26 BG1.29 BG1.34 BG1.75 BG1.90 BG1.102 BG1.110 BG1.119 BG1.121 BG1.132 BG1.147 BG1.152 BG1.157 BG1.161 BG1.166 BG1.A2 BG1.B2 BG1.G2 BG1.G4 BG1.H2 BG1.H3 BG1.H4 BG1.I2 BG1.I4 C200.1 C201.1
GNDA_ADC: BG1.55 BG1.80 BG1.G5
SYS_5V: BG1.B4
VDD_1V8: BG1.C3 BG1.C4
VDD_3V3A: BG1.G1
VDD_3V3B: BG1.B1 BG1.C1
VDD_5V: BG1.A4 BG1.A5
VDD_ADC: BG1.81 BG1.H5
VDD_CORE: BG1.A3 BG1.H1 BG1.I1 TP22.1(Pin)
VDD_MPU: BG1.B3 C200.2
VDD_PLL: BG1.C2 C201.2
VDD_S: BG1.C5 BG1.G3
VDD_USB_DC: BG1.B5 TP23.1(Pin)
VDDS_DDR: BG1.I3 BG1.I5
AIN0: BG1.59 ; port AIN0
AIN1: BG1.84 ; port AIN1
AIN2: BG1.58 ; port AIN2
AIN3: BG1.83 ; port AIN3
AIN4: BG1.57 ; port AIN4
AIN5: BG1.82 ; port AIN5
AIN6: BG1.56 ; port AIN6
BAT1: BG1.60 ; port BAT1
BAT_SENSE: BG1.61 ; port BAT_SENSE
BAT_TS: BG1.62 ; port BAT_TS
BKL_FB_WLED: BG1.16 TP13.1(Pin) ; port BKL_FB_WLED
BKL_ISET1: BG1.14 TP11.1(Pin) ; port BKL_ISET1
BKL_ISET2: BG1.13 TP10.1(Pin) ; port BKL_ISET2
BKL_ISINK1: BG1.31 TP15.1(Pin) ; port BKL_ISINK1
BKL_ISINK2: BG1.30 TP14.1(Pin) ; port BKL_ISINK2
BKL_L4: BG1.15 TP12.1(Pin) ; port BKL_L4
CLKOUT_SRC: BG1.76 ; port CLKOUT_SRC
EHRPWM1A: BG1.38 ; port EHRPWM1A
EHRPWM1B: BG1.39 ; port EHRPWM1B
EHRPWM2A: BG1.154 ; port EHRPWM2A
EHRPWM2B: BG1.155 ; port EHRPWM2B
eMMC_RSTn: BG1.122 TP19.1(Pin) ; port eMMC_RSTn
GPIO0_7SRC: BG1.68 ; port GPIO0_7SRC
GPIO0_26: BG1.133 ; port GPIO0_26
GPIO0_27: BG1.134 ; port GPIO0_27
GPIO1_12: BG1.162 ; port GPIO1_12
GPIO1_13: BG1.137 ; port GPIO1_13
GPIO1_14: BG1.163 ; port GPIO1_14
GPIO1_15: BG1.138 ; port GPIO1_15
GPIO1_17: BG1.160 ; port GPIO1_17
GPIO1_28: BG1.37 ; port GPIO1_28
GPIO1_29: BG1.153 ; port GPIO1_29
GPIO2_1: BG1.158 ; port GPIO2_1
GPIO3_18: BG1.85 ; port GPIO3_18
GPIO3_19: BG1.86 ; port GPIO3_19
GPIO3_20: BG1.87 ; port GPIO3_20
GPIO3_21: BG1.88 ; port GPIO3_21
GPIO_1_16: BG1.139 ; port GPIO_1_16
GPIO_2_0: BG1.159 ; port GPIO_2_0
HDMI_INT: BG1.135 ; port HDMI_INT
HDMICLK_DISn: BG1.136 ; port HDMICLK_DISn
I2C0_SCL: BG1.32 ; port I2C0_SCL
I2C0_SDA: BG1.33 ; port I2C0_SDA
I2C1_SCL: BG1.50 ; port I2C1_SCL
I2C1_SDA: BG1.49 ; port I2C1_SDA
I2C2_SCL: BG1.72 ; port I2C2_SCL
I2C2_SDA: BG1.71 ; port I2C2_SDA
JTAG_EMU0: BG1.77 ; port JTAG_EMU0
JTAG_EMU1: BG1.51 ; port JTAG_EMU1
JTAG_TCK: BG1.52 ; port JTAG_TCK
JTAG_TDI: BG1.78 ; port JTAG_TDI
JTAG_TDO: BG1.53 ; port JTAG_TDO
JTAG_TMS: BG1.79 ; port JTAG_TMS
JTAG_TRSTn: BG1.54 ; port JTAG_TRSTn
LCD_DATA0: BG1.94 ; port LCD_DATA0
LCD_DATA1: BG1.111 ; port LCD_DATA1
LCD_DATA2: BG1.95 ; port LCD_DATA2
LCD_DATA3: BG1.112 ; port LCD_DATA3
LCD_DATA4: BG1.96 ; port LCD_DATA4
LCD_DATA5: BG1.113 ; port LCD_DATA5
LCD_DATA6: BG1.97 ; port LCD_DATA6
LCD_DATA7: BG1.114 ; port LCD_DATA7
LCD_DATA8: BG1.98 ; port LCD_DATA8
LCD_DATA9: BG1.115 ; port LCD_DATA9
LCD_DATA10: BG1.99 ; port LCD_DATA10
LCD_DATA11: BG1.116 ; port LCD_DATA11
LCD_DATA12: BG1.100 ; port LCD_DATA12
LCD_DATA13: BG1.117 ; port LCD_DATA13
LCD_DATA14: BG1.101 ; port LCD_DATA14
LCD_DATA15: BG1.118 ; port LCD_DATA15
LCDDE: BG1.120 ; port LCDDE
LCDPCLK: BG1.144 ; port LCDPCLK
LCDVHYNC: BG1.145 ; port LCDHSYNC
LCDVSYNC: BG1.146 ; port LCDVSYNC
MDIO_CLK: BG1.20 ; port MDIO_CLK
MDIO_DATA: BG1.19 ; port MDIO_DATA
MII1_COL: BG1.12 ; port MII1_COL
MII1_CRS_DV: BG1.28 ; port MII1_CRS_DV
MII1_REFCLK: BG1.11 ; port MII1_REFCLK
MII1_RXCLK: BG1.6 ; port MII1_RXCLK
MII1_RXD0: BG1.21 ; port MII1_RXD0
MII1_RXD1: BG1.22 ; port MII1_RXD1
MII1_RXD2: BG1.4 ; port MII1_RXD2
MII1_RXD3: BG1.5 ; port MII1_RXD3
MII1_RXDV: BG1.9 ; port MII1_RXDV
MII1_RXERR: BG1.27 ; port MII1_RXERR
MII1_TXCLK: BG1.23 ; port MII1_TXCLK
MII1_TXD0: BG1.24 ; port MII1_TXD0
MII1_TXD1: BG1.7 ; port MII1_TXD1
MII1_TXD2: BG1.25 ; port MII1_TXD2
MII1_TXD3: BG1.8 ; port MII1_TXD3
MII1_TXEN: BG1.10 ; port MII1_TXEN
MMC0_CD: BG1.42 ; port MMC0_CD
MMC0_CLKO: BG1.65 ; port MMC0_CLKO
MMC0_CMD: BG1.64 ; port MMC0_CMD
MMC0_DAT0: BG1.67 ; port MMC0_DAT0
MMC0_DAT1: BG1.41 ; port MMC0_DAT1
MMC0_DAT2: BG1.66 ; port MMC0_DAT2
MMC0_DAT3: BG1.40 ; port MMC0_DAT3
MMC1_CLK: BG1.131 ; port MMC1_CLK
MMC1_CMD: BG1.156 ; port MMC1_CMD
MMC1_DAT0: BG1.123 ; port MMC1_DAT0
MMC1_DAT1: BG1.124 ; port MMC1_DAT1
MMC1_DAT2: BG1.125 ; port MMC1_DAT2
MMC1_DAT3: BG1.126 ; port MMC1_DAT3
MMC1_DAT4: BG1.127 ; port MMC1_DAT4
MMC1_DAT5: BG1.128 ; port MMC1_DAT5
MMC1_DAT6: BG1.129 ; port MMC1_DAT6
MMC1_DAT7: BG1.130 ; port MMC1_DAT7
PWR_BUT: BG1.63 ; port PWR_BUT
SPI1_CS0: BG1.106 ; port SPI1_CS0
SPI1_D0: BG1.104 ; port SPI1_D0
SPI1_D1: BG1.105 ; port SPI1_D1
SPI1_SCLK: BG1.103 ; port SPI1_SCLK
SYS_RESETn: BG1.48 ; port SYS_RESETn
TIMER4: BG1.148 ; port TIMER4
TIMER5: BG1.149 ; port TIMER5
TIMER6: BG1.150 ; port TIMER6
TIMER7: BG1.151 ; port TIMER7
UART0_CTS#: BG1.44 TP16.1(Pin) ; port UART0_CTS#
UART0_RTS#: BG1.45 TP17.1(Pin) ; port UART0_RTS#
UART0_RX: BG1.47 ; port UART0_RX
UART0_TX: BG1.46 ; port UART0_TX
UART1_RXD: BG1.73 ; port UART1_RXD
UART1_TXD: BG1.74 ; port UART1_TXD
UART2_RXD: BG1.69 ; port UART2_RXD
UART2_TXD: BG1.70 ; port UART2_TXD
UART4_RXD: BG1.36 ; port UART4_RXD
UART4_TXD: BG1.35 ; port UART4_TXD
USB0_CE: BG1.143 TP20.1(Pin) ; port USB0_CE
USB0_D_N: BG1.2 ; port USB0_D_N
USB0_D_P: BG1.1 ; port USB0_D_P
USB0_DRVVBUS: BG1.168 TP21.1(Pin) ; port USB0_DRVVBUS
USB0_ID: BG1.167 ; port USB0_ID
USB0_VBUS: BG1.142 ; port USB0_VBUS
USB1_CE: BG1.108 TP18.1(Pin) ; port USB1_CE
USB1_D_N: BG1.92 ; port USB1_D_N
USB1_D_P: BG1.91 ; port USB1_D_P
USB1_DRVVBUS: BG1.107 ; port USB1_DRVVBUS
USB1_ID: BG1.89 ; port USB1_ID
USB1_OCn: BG1.93 ; port USB1_OCn
USB1_VBUS: BG1.109 ; port USB1_VBUS
USR0: BG1.164 ; port USR0
USR1: BG1.140 ; port USR1
USR2: BG1.165 ; port USR2
USR3: BG1.141 ; port USR3
XDMA_EVENT_INTR0: BG1.43 ; port XDMA_EVENT_INTR0

### Layout directives
differential pair: USB0_D_N, USB0_D_P, USB1_D_N, USB1_D_P
net class MMC1: (no net found under the mark)
net class USB_0: (no net found under the mark)
net class USB_1: (no net found under the mark)
net class MII: (no net found under the mark), DGND

### Notes on the sheet
- Capacitors on Base bord
- e.g. VDD MPU etc.
- Date
- Name
- REV.:
- editor:
- CAD:
- - SL (3)
- sheet:
- LK :
- checked:
- of:
- (in symbol BG_BCM, part A) left
- (in symbol BG_BCM, part B) down
- (in symbol BG_BCM, part C) right
- (in symbol BG_BCM, part D) up
- (in symbol BG_BCM, part E) Power

### Library data of the parts
BG1 = BG_BCM: Beaglecore; Value: BG_BCM
C200 C201 = C2.2uF/6V3_02: Capacitor 0402;  6V3;  X5R; Value: 2.2uF/6V3_02
TP10-TP18 TP20-TP23 = TP1.6 mit Bohrung 0.8: Testpunkt rund mit Bohrung D=0.8mm; Value: TP THT
TP19 = TP1.6 mit Bohrung 0.8: Testpunkt rund mit Bohrung D=0.8mm; S/T: mech; erstellt von: Finke; Published: 24-Mar-1999; Art Nr.: *; Value: TP THT

## Sheet P05_BCS1_Ethernet.SchDoc
size A3; Date: 24.11.2011; CheckedBy: Finke; Author: Mierau; DrawnBy: Mierau; SheetNumber: 5; SheetTotal: 8; Anlage: 78; Beschreibung: Qseven; Kunde: 56; ProjektName: BCS1; ProjektNummer: 88xxx; Ersatz_fuer: 12; ersetzt_durch: 34; LKNummer: 6190202; ID_Nummer: 90
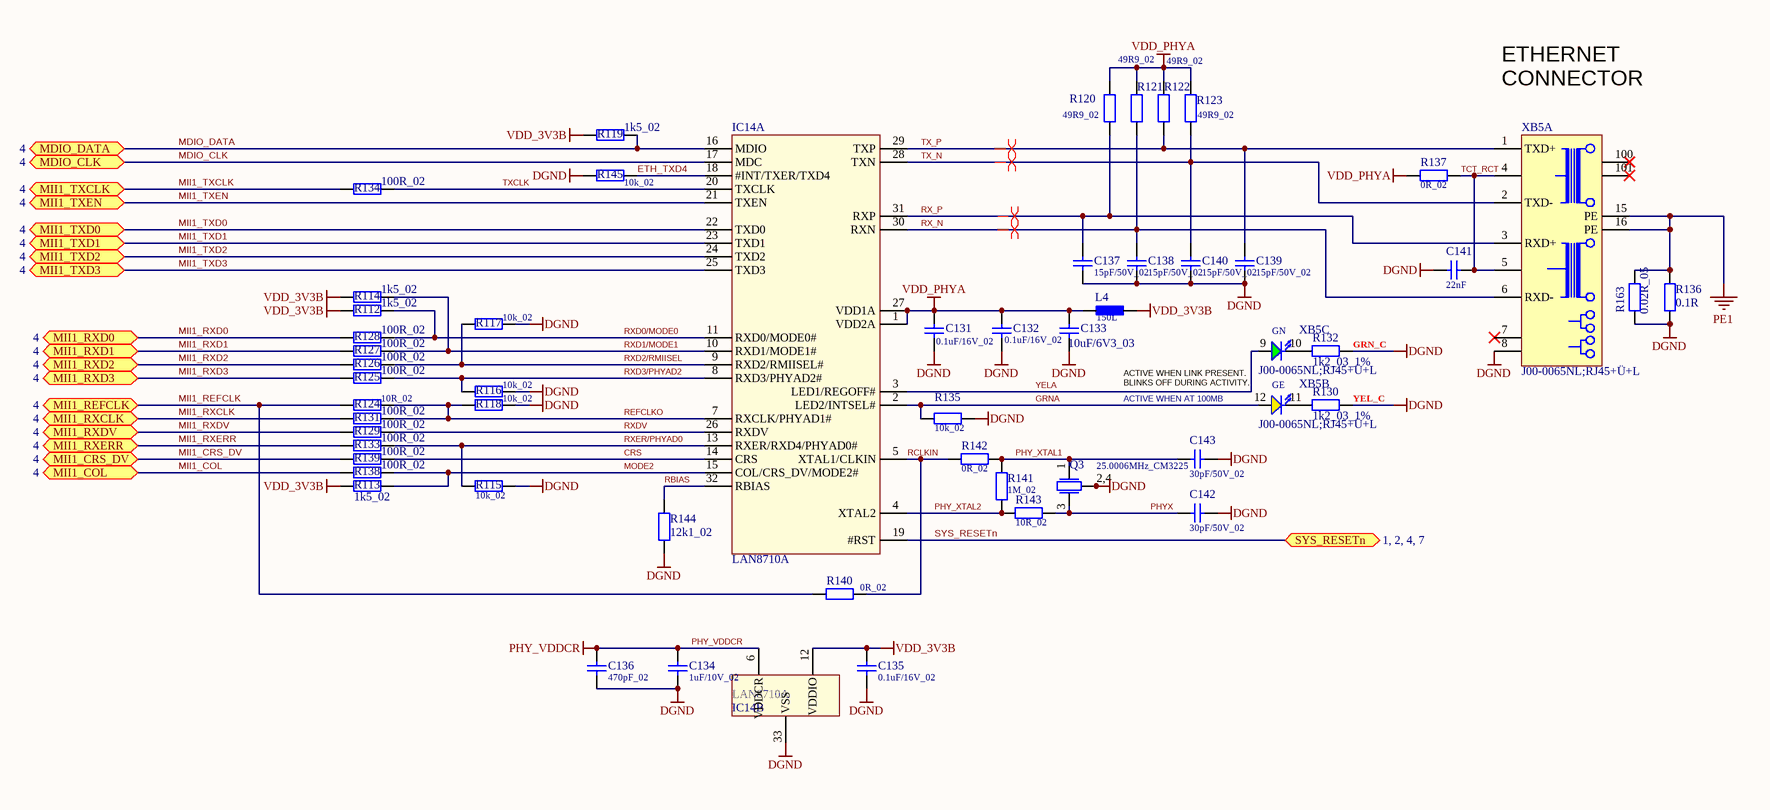
[diagram p4: P05_BCS1_Ethernet.SchDoc]

### Parts
C131  0.1uF/16V_02  [CC1005-0402]
C132  0.1uF/16V_02  [CC1005-0402]
C133  10uF/6V3_03  [CC1608-0603]
C134  1uF/10V_02  [CC1005-0402]
C135  0.1uF/16V_02  [CC1005-0402]
C136  470pF_02  [CC1005-0402]
C137  15pF/50V_02  [CC1005-0402]
C138  15pF/50V_02  [CC1005-0402]
C139  15pF/50V_02  [CC1005-0402]
C140  15pF/50V_02  [CC1005-0402]
C141  22nF  [CC2012-0805]
C142  30pF/50V_02  [CC1005-0402]
C143  30pF/50V_02  [CC1005-0402]
IC14  LAN8710A  [QFN32+EP]  (parts A,B of 2)
L4  150L  [CR2012-0805]
Q3  25.0006MHz_CM3225  [QUARZ CM3225]
R112  1k5_02  [CR1005-0402]
R113  1k5_02  [CR1005-0402]
R114  1k5_02  [CR1005-0402]
R115  10k_02  [CR1005-0402]
R116  10k_02  [CR1005-0402]
R117  10k_02  [CR1005-0402]
R118  10k_02  [CR1005-0402]
R119  1k5_02  [CR1005-0402]
R120  49R9_02  [CR1005-0402]
R121  49R9_02  [CR1005-0402]
R122  49R9_02  [CR1005-0402]
R123  49R9_02  [CR1005-0402]
R124  10R_02  [CR1005-0402]
R125  100R_02  [CR1005-0402]
R126  100R_02  [CR1005-0402]
R127  100R_02  [CR1005-0402]
R128  100R_02  [CR1005-0402]
R129  100R_02  [CR1005-0402]
R130  1k2_03_1%  [CR1608-0603]
R131  100R_02  [CR1005-0402]
R132  1k2_03_1%  [CR1608-0603]
R133  100R_02  [CR1005-0402]
R134  100R_02  [CR1005-0402]
R135  10k_02  [CR1005-0402]
R136  0.1R  [CR3216-1206]
R137  0R_02  [CR1005-0402]
R138  100R_02  [CR1005-0402]
R139  100R_02  [CR1005-0402]
R140  0R_02  [CR1005-0402]
R141  1M_02  [CR1005-0402]
R142  0R_02  [CR1005-0402]
R143  10R_02  [CR1005-0402]
R144  12k1_02  [CR1005-0402]
R145  10k_02  [CR1005-0402]
R163  0.02R_05  [CR2012-0805]
XB5  J00-0065NL;RJ45+Ü+L  [RJ45+Ü+L]  (parts A,B,C of 3)

### Ports
MDIO_CLK (see 4), MDIO_DATA (see 4), MII1_COL (see 4), MII1_CRS_DV (see 4), MII1_REFCLK (see 4), MII1_RXCLK (see 4), MII1_RXD0 (see 4), MII1_RXD1 (see 4), MII1_RXD2 (see 4), MII1_RXD3 (see 4), MII1_RXDV (see 4), MII1_RXERR (see 4), MII1_TXCLK (see 4), MII1_TXD0 (see 4), MII1_TXD1 (see 4), MII1_TXD2 (see 4), MII1_TXD3 (see 4), MII1_TXEN (see 4), SYS_RESETn (see 1, 2, 4, 7)

### Nets
DGND: C131.1 C132.1 C133.1 C134.1 C135.2 C136.1 C137.1 C138.1 C139.1 C140.1 C141.1 C142.2 C143.2 IC14.33(VSS) Q3.2(GND) Q3.4(GND) R115.2 R116.2 R117.2 R118.2 R130.2 R132.2 R135.2 R136.1 R144.2 R145.1 R163.1 XB5.8(NC)
PE1: R136.2 R163.2 XB5.15(PE) XB5.16(PE)
PHY_VDDCR: C134.2 C136.2 IC14.6(VDDCR)
VDD_3V3B: C135.1 IC14.12(VDDIO) L4.2 R112.2 R113.1 R114.2 R119.2
VDD_PHYA: C131.2 C132.2 C133.2 IC14.1(VDD2A) IC14.27(VDD1A) L4.1 R120.1 R121.1 R122.1 R123.1 R137.2
CRS: IC14.14(CRS) R139.2
ETH_TXD4: IC14.18(#INT/TXER/TXD4) R145.2
GRNA: IC14.2(LED2/INTSEL#) R135.1 XB5.12(A)
MDIO_CLK: IC14.17(MDC) ; port MDIO_CLK
MDIO_DATA: IC14.16(MDIO) R119.1 ; port MDIO_DATA
MII1_COL: R138.1 ; port MII1_COL
MII1_CRS_DV: R139.1 ; port MII1_CRS_DV
MII1_REFCLK: R124.1 R140.1 ; port MII1_REFCLK
MII1_RXCLK: R131.1 ; port MII1_RXCLK
MII1_RXD0: R128.1 ; port MII1_RXD0
MII1_RXD1: R127.1 ; port MII1_RXD1
MII1_RXD2: R126.1 ; port MII1_RXD2
MII1_RXD3: R125.1 ; port MII1_RXD3
MII1_RXDV: R129.1 ; port MII1_RXDV
MII1_RXERR: R133.1 ; port MII1_RXERR
MII1_TXCLK: R134.1 ; port MII1_TXCLK
MII1_TXD0: IC14.22(TXD0) ; port MII1_TXD0
MII1_TXD1: IC14.23(TXD1) ; port MII1_TXD1
MII1_TXD2: IC14.24(TXD2) ; port MII1_TXD2
MII1_TXD3: IC14.25(TXD3) ; port MII1_TXD3
MII1_TXEN: IC14.21(TXEN) ; port MII1_TXEN
MODE2: IC14.15(COL/CRS_DV/MODE2#) R113.2 R138.2
PHY_XTAL1: C143.1 Q3.1(X1) R141.1 R142.2
PHY_XTAL2: IC14.4(XTAL2) R141.2 R143.1
PHYX: C142.1 Q3.3(X2) R143.2
RBIAS: IC14.32(RBIAS) R144.1
RCLKIN: IC14.5(XTAL1/CLKIN) R140.2 R142.1
REFCLKO: IC14.7(RXCLK/PHYAD1#) R118.1 R124.2 R131.2
RX_N: C138.2 IC14.30(RXN) R121.2 XB5.6(RXD-)
RX_P: C137.2 IC14.31(RXP) R120.2 XB5.3(RXD+)
RXD0/MODE0: IC14.11(RXD0/MODE0#) R112.1 R128.2
RXD1/MODE1: IC14.10(RXD1/MODE1#) R114.1 R127.2
RXD2/RMIISEL: IC14.9(RXD2/RMIISEL#) R117.1 R126.2
RXD3/PHYAD2: IC14.8(RXD3/PHYAD2#) R116.1 R125.2
RXDV: IC14.26(RXDV) R129.2
RXER/PHYAD0: IC14.13(RXER/RXD4/PHYAD0#) R115.1 R133.2
SYS_RESETn: IC14.19(#RST) ; port SYS_RESETn
TCT_RCT: C141.2 R137.1 XB5.4(NC) XB5.5(NC)
TX_N: C140.2 IC14.28(TXN) R123.2 XB5.2(TXD-)
TX_P: C139.2 IC14.29(TXP) R122.2 XB5.1(TXD+)
TXCLK: IC14.20(TXCLK) R134.2
YELA: IC14.3(LED1/REGOFF#) XB5.9(A)
NetR130_1: R130.1 XB5.11(K)
NetR132_1: R132.1 XB5.10(K)

Not connected (* = marked no-connect by the designer): XB5 7(NC)* 100* 101*

### Layout directives
differential pair: RX_N, RX_P, TX_N, TX_P

### Notes on the sheet
- (near XB5) ETHERNET
  CONNECTOR
- (near R132) GRN_C
- ACTIVE WHEN LINK PRESENT.
  BLINKS OFF DURING ACTIVITY.
- ACTIVE WHEN AT 100MB
- (near R130) YEL_C
- Date
- Name
- REV.:
- editor:
- CAD:
- - SL (3)
- sheet:
- LK :
- checked:
- of:
- (in symbol Q25.0006MHz_CM3225) 2,4
- (in symbol XBRJ45-J00-0065_ML, part B) GE
- (in symbol XBRJ45-J00-0065_ML, part C) GN

### Library data of the parts
C131 C132 C135 = C0.1uF/16V_02: Capacitor 0402 16V Y5V; Value: 0.1uF/16V_02
C133 = C10uF/6V3_03: Capacitor 0603 6V3; 10%, X5R; Value: 10uF/6V3_03
C134 = C1uF/10V_02: Capacitor 0402 10V, X5R; Value: 1uF/10V_02
C136 = C470pF_02: Capacitor 0402; 50V X7R; Value: 470pF_02
C137-C140 = C15pF/50V_02: Capacitor 0402; 50V; Value: 15pF/50V_02
C141 = C22nF: Capacitor 0805; 50V; 10%; Value: 22nF
C142 C143 = C30pF/16V_02: Capacitor 0402 50V Y5V; Value: 30pF/50V_02
IC14 = ICLAN8710A: Small Footprint MII/RMII 10/100 Ethernet  Transceiver with HP Auto-MDIX and  flexPWR® Technology; Hersteller: SMSC-Microchip; Bestellbezeichnung: LAN8710A-EZK; Value: LAN8710A
L4 = L150 Ohm Ferrite: as L7 on sheet P03_BCS1_USB, Serial, uSD; Value: 150L
Q3 = Q25.0006MHz_CM3225: Quarz 25.0006MHz; CM3225; Hersteller: Comtec Crystal; Bestellbezeichnung: CM3225- 25.0006MHz; Hersteller1: Geyer; Bestellbezeichnung1: CM3225- 25.0006MHz; Value: 25.0006MHz_CM3225
R112-R114 R119 = R1k5_02: Resistor 0402 1/16W 1%; Value: 1k5_02
R115-R118 R135 R145 = R10k_02: Resistor 0402; Value: 10k_02
R120-R123 = R49R9_02: Resistor 0402; Value: 49R9_02
R124 R143 = R10R_02: Resistor 0402; Value: 10R_02
R125-R129 R131 R133 R134 R138 R139 = R100R_02: Resistor 0402 1%; Value: 100R_02
R130 R132 = R1k2_03_1%: Resistor 0603; 1% 1/16W; Value: 1k2_03_1%
R136 = R0.1R: Resistor 1206; 1% 1/4W;; Value: 0.1R
R137 R140 R142 = R0R_02: Resistor 0402; Value: 0R_02
R141 = R1M_02: Resistor 0402; Value: 1M_02
R144 = R12k1_02: Resistor 0402; 1%; Value: 12k1_02
R163 = R0.02R_05: Resistor Bauform 0805; 5% 1/4W;; Value: 0.02R_05
XB5 = XBRJ45-J00-0065_ML: Buchse RJ45 mit Übertrager und LEDS; Hersteller: Pulse; Bestellbezeichnung1: 7499010211A; Hersteller1: Würth; Bestellbezeichnung: J00-0065NL; Value: J00-0065NL;RJ45+Ü+L

## Sheet P06_BCS1_HDMI Framer.SchDoc
size A3; Date: 24.11.2011; CheckedBy: Finke; Author: Mierau; DrawnBy: Mierau; SheetNumber: 6; SheetTotal: 8; Anlage: 78; Beschreibung: Qseven; Kunde: 56; ProjektName: BCS1; ProjektNummer: 88xxx; Ersatz_fuer: 12; ersetzt_durch: 34; LKNummer: 6190202; ID_Nummer: 90
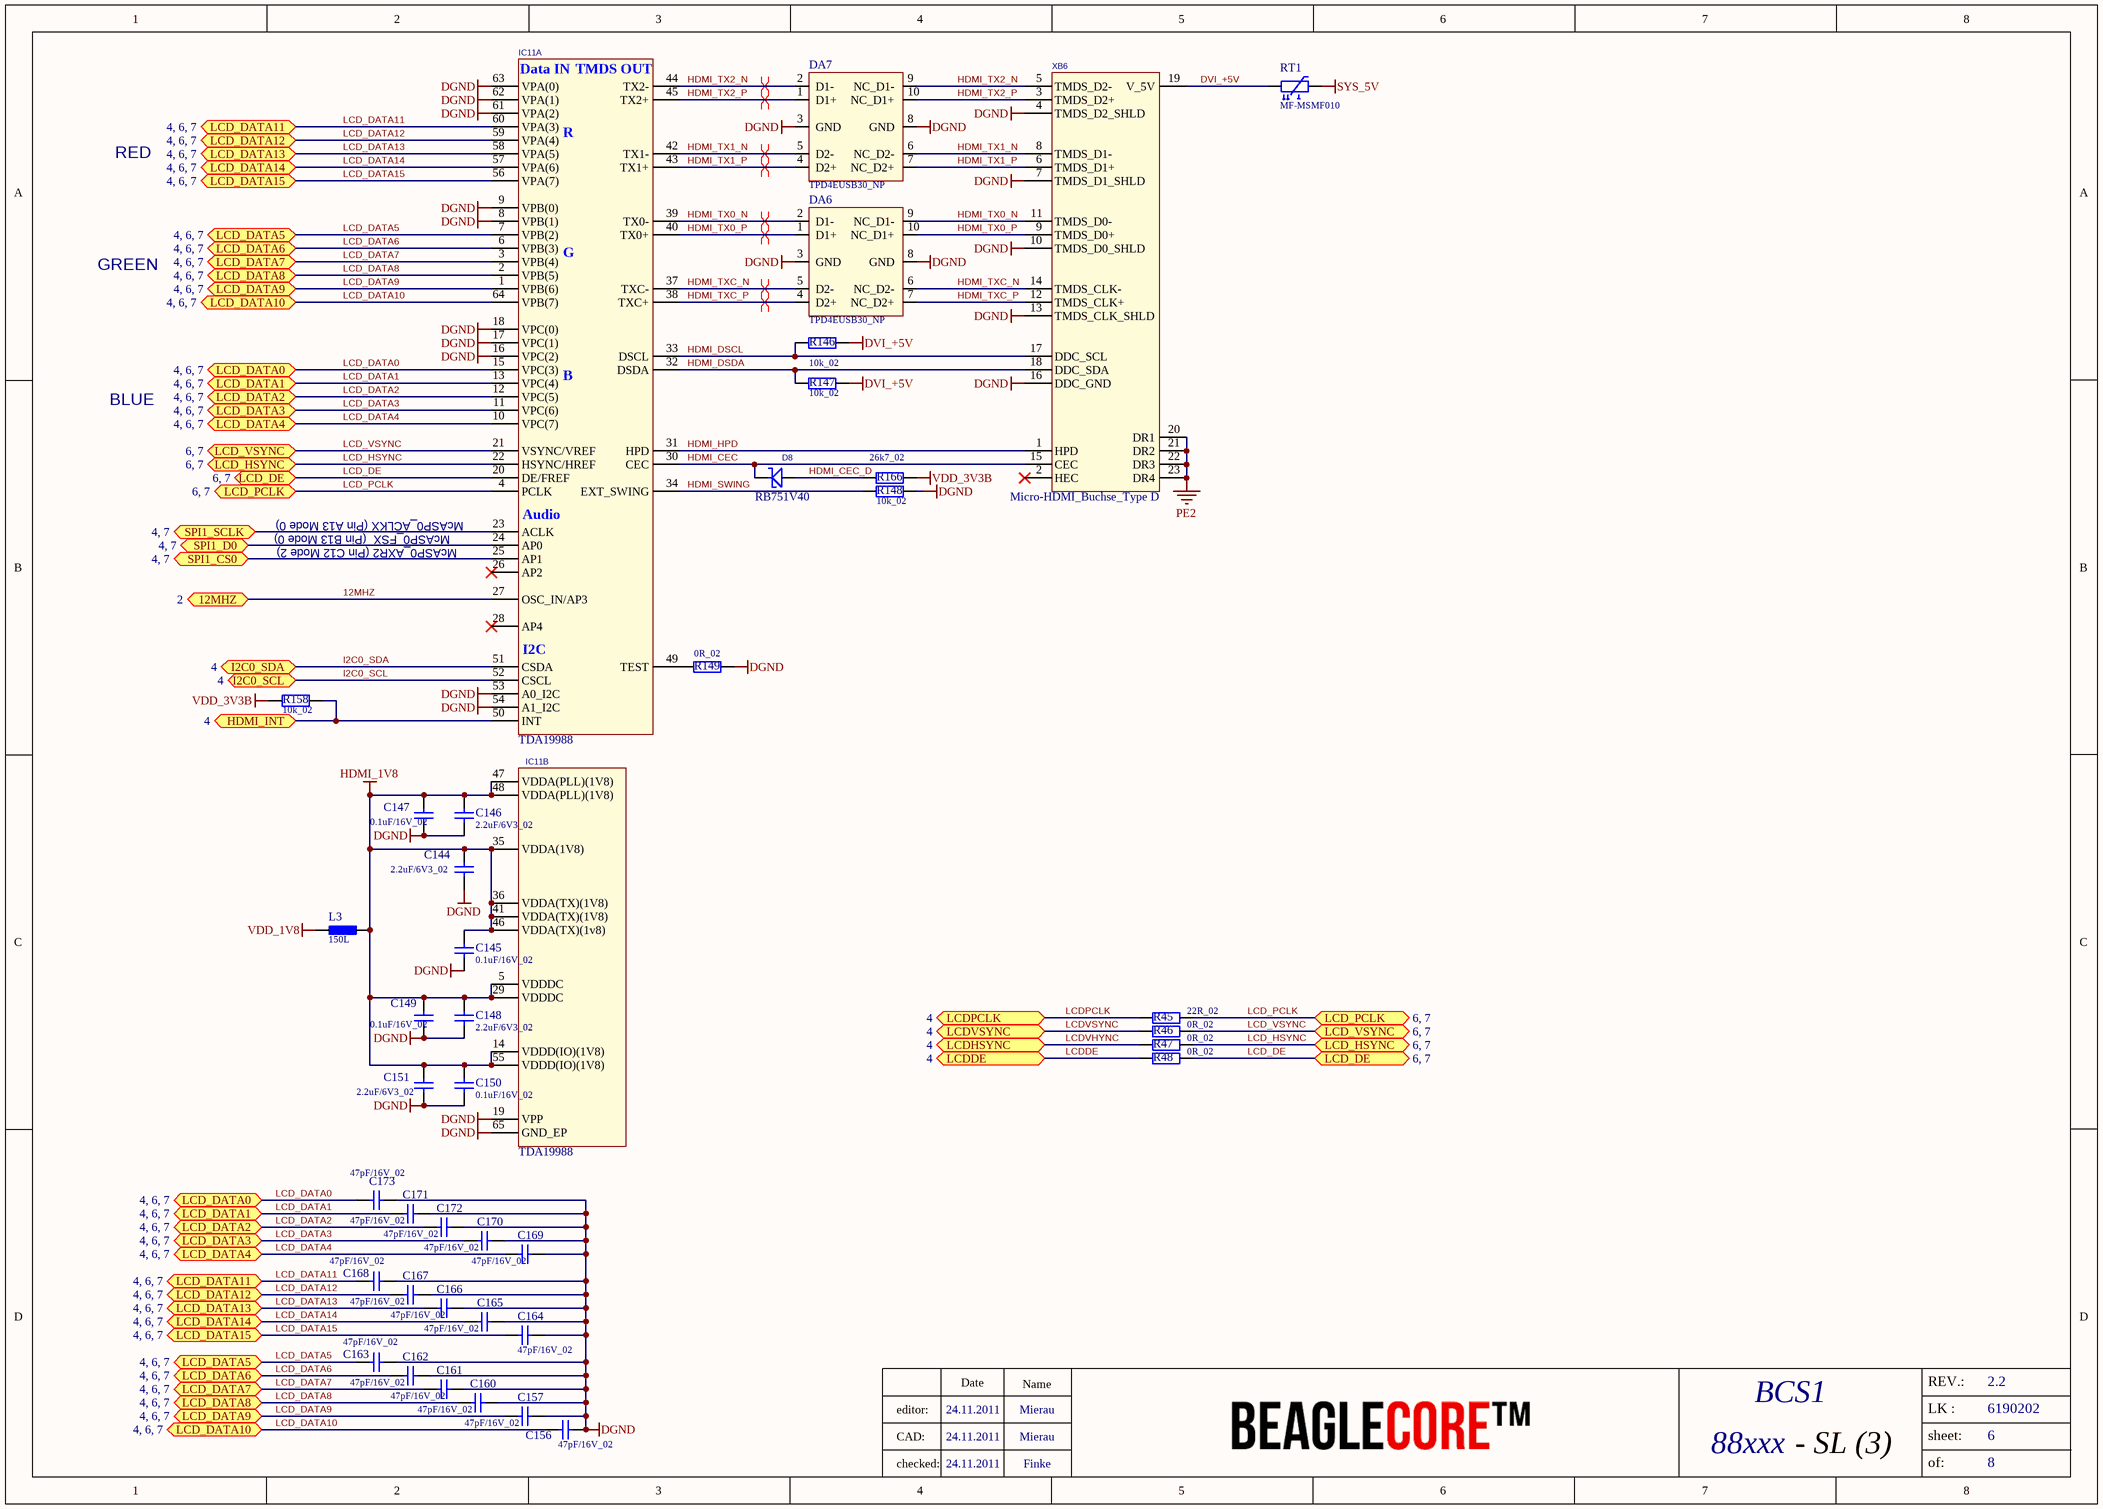
[diagram p5: P06_BCS1_HDMI Framer.SchDoc]

### Parts
C144  2.2uF/6V3_02  [CC1005-0402]
C145  0.1uF/16V_02  [CC1005-0402]
C146  2.2uF/6V3_02  [CC1005-0402]
C147  0.1uF/16V_02  [CC1005-0402]
C148  2.2uF/6V3_02  [CC1005-0402]
C149  0.1uF/16V_02  [CC1005-0402]
C150  0.1uF/16V_02  [CC1005-0402]
C151  2.2uF/6V3_02  [CC1005-0402]
C156  47pF/16V_02  [CC1005-0402]
C157  47pF/16V_02  [CC1005-0402]
C160  47pF/16V_02  [CC1005-0402]
C161  47pF/16V_02  [CC1005-0402]
C162  47pF/16V_02  [CC1005-0402]
C163  47pF/16V_02  [CC1005-0402]
C164  47pF/16V_02  [CC1005-0402]
C165  47pF/16V_02  [CC1005-0402]
C166  47pF/16V_02  [CC1005-0402]
C167  47pF/16V_02  [CC1005-0402]
C168  47pF/16V_02  [CC1005-0402]
C169  47pF/16V_02  [CC1005-0402]
C170  47pF/16V_02  [CC1005-0402]
C171  47pF/16V_02  [CC1005-0402]
C172  47pF/16V_02  [CC1005-0402]
C173  47pF/16V_02  [CC1005-0402]
D8  RB751V40  [SOD323]
DA6  TPD4EUSB30_NP  [TPD4EUSB30]
DA7  TPD4EUSB30_NP  [TPD4EUSB30]
IC11  TDA19988  [HVQFN64+EP_N]  (parts A,B of 2)
L3  150L  [CR2012-0805]
R45  22R_02  [CR1005-0402]
R46  0R_02  [CR1005-0402]
R47  0R_02  [CR1005-0402]
R48  0R_02  [CR1005-0402]
R146  10k_02  [CR1005-0402]
R147  10k_02  [CR1005-0402]
R148  10k_02  [CR1005-0402]
R149  0R_02  [CR1005-0402]
R158  10k_02  [CR1005-0402]
R166  26k7_02  [CR1005-0402]
RT1  MF-MSMF010  [FUSE-MF-MSMF]
XB6  Micro-HDMI_Buchse_Type D  [Micro_HDMI_FCI_SMT_Type D]

### Ports
12MHZ (see 2), HDMI_INT (see 4), I2C0_SCL (see 4), I2C0_SDA (see 4), LCD_DATA0 (see 4, 6, 7), LCD_DATA1 (see 4, 6, 7), LCD_DATA2 (see 4, 6, 7), LCD_DATA3 (see 4, 6, 7), LCD_DATA4 (see 4, 6, 7), LCD_DATA5 (see 4, 6, 7), LCD_DATA6 (see 4, 6, 7), LCD_DATA7 (see 4, 6, 7), LCD_DATA8 (see 4, 6, 7), LCD_DATA9 (see 4, 6, 7), LCD_DATA10 (see 4, 6, 7), LCD_DATA11 (see 4, 6, 7), LCD_DATA12 (see 4, 6, 7), LCD_DATA13 (see 4, 6, 7), LCD_DATA14 (see 4, 6, 7), LCD_DATA15 (see 4, 6, 7), LCD_DE (see 6, 7), LCD_HSYNC (see 6, 7), LCD_PCLK (see 6, 7), LCD_VSYNC (see 6, 7), LCDDE (bidir, see 4), LCDHSYNC (bidir, see 4), LCDPCLK (bidir, see 4), LCDVSYNC (bidir, see 4), SPI1_CS0 (see 4, 7), SPI1_D0 (see 4, 7), SPI1_SCLK (see 4, 7)

### Nets
DGND: C144.1 C145.2 C146.1 C147.2 C148.1 C149.2 C150.2 C151.2 C156.2 C157.2 C160.2 C161.2 C162.2 C163.2 C164.2 C165.2 C166.2 C167.2 C168.2 C169.2 C170.2 C171.2 C172.2 C173.2 DA6.3(GND) DA6.8(GND) DA7.3(GND) DA7.8(GND) IC11.8(VPB(1)) IC11.9(VPB(0)) IC11.16(VPC(2)) IC11.17(VPC(1)) IC11.18(VPC(0)) IC11.19(VPP) IC11.53(A0_I2C) IC11.54(A1_I2C) IC11.61(VPA(2)) IC11.62(VPA(1)) IC11.63(VPA(0)) IC11.65(GND_EP) R148.2 R149.2 XB6.4(TMDS_D2_SHLD) XB6.7(TMDS_D1_SHLD) XB6.10(TMDS_D0_SHLD) XB6.13(TMDS_CLK_SHLD) XB6.16(DDC_GND)
DVI_+5V: R146.2 R147.1 RT1.2 XB6.19(V_5V)
HDMI_1V8: C144.2 C145.1 C146.2 C147.1 C148.2 C149.1 C150.1 C151.1 IC11.5(VDDDC) IC11.14(VDDD(IO)(1V8)) IC11.29(VDDDC) IC11.35(VDDA(1V8)) IC11.36(VDDA(TX)(1V8)) IC11.41(VDDA(TX)(1V8)) IC11.46(VDDA(TX)(1v8)) IC11.47(VDDA(PLL)(1V8)) IC11.48(VDDA(PLL)(1V8)) IC11.55(VDDD(IO)(1V8)) L3.1
PE2: XB6.20(DR1) XB6.21(DR2) XB6.22(DR3) XB6.23(DR4)
SYS_5V: RT1.1
VDD_1V8: L3.2
VDD_3V3B: R158.1 R166.2
12MHZ: IC11.27(OSC_IN/AP3) ; port 12MHZ
HDMI_CEC: D8.1 IC11.30(CEC) XB6.15(CEC)
HDMI_CEC_D: D8.2(Anode) R166.1
HDMI_DSCL: IC11.33(DSCL) R146.1 XB6.17(DDC_SCL)
HDMI_DSDA: IC11.32(DSDA) R147.2 XB6.18(DDC_SDA)
HDMI_HPD: IC11.31(HPD) XB6.1(HPD)
HDMI_INT: IC11.50(INT) R158.2 ; port HDMI_INT
HDMI_SWING: IC11.34(EXT_SWING) R148.1
HDMI_TX0_N: DA6.2(D1-) DA6.9(NC_D1-) IC11.39(TX0-) XB6.11(TMDS_D0-)
HDMI_TX0_P: DA6.1(D1+) DA6.10(NC_D1+) IC11.40(TX0+) XB6.9(TMDS_D0+)
HDMI_TX1_N: DA7.5(D2-) DA7.6(NC_D2-) IC11.42(TX1-) XB6.8(TMDS_D1-)
HDMI_TX1_P: DA7.4(D2+) DA7.7(NC_D2+) IC11.43(TX1+) XB6.6(TMDS_D1+)
HDMI_TX2_N: DA7.2(D1-) DA7.9(NC_D1-) IC11.44(TX2-) XB6.5(TMDS_D2-)
HDMI_TX2_P: DA7.1(D1+) DA7.10(NC_D1+) IC11.45(TX2+) XB6.3(TMDS_D2+)
HDMI_TXC_N: DA6.5(D2-) DA6.6(NC_D2-) IC11.37(TXC-) XB6.14(TMDS_CLK-)
HDMI_TXC_P: DA6.4(D2+) DA6.7(NC_D2+) IC11.38(TXC+) XB6.12(TMDS_CLK+)
I2C0_SCL: IC11.52(CSCL) ; port I2C0_SCL
I2C0_SDA: IC11.51(CSDA) ; port I2C0_SDA
LCD_DATA0: C173.1 IC11.15(VPC(3)) ; port LCD_DATA0
LCD_DATA1: C171.1 IC11.13(VPC(4)) ; port LCD_DATA1
LCD_DATA2: C172.1 IC11.12(VPC(5)) ; port LCD_DATA2
LCD_DATA3: C170.1 IC11.11(VPC(6)) ; port LCD_DATA3
LCD_DATA4: C169.1 IC11.10(VPC(7)) ; port LCD_DATA4
LCD_DATA5: C163.1 IC11.7(VPB(2)) ; port LCD_DATA5
LCD_DATA6: C162.1 IC11.6(VPB(3)) ; port LCD_DATA6
LCD_DATA7: C161.1 IC11.3(VPB(4)) ; port LCD_DATA7
LCD_DATA8: C160.1 IC11.2(VPB(5)) ; port LCD_DATA8
LCD_DATA9: C157.1 IC11.1(VPB(6)) ; port LCD_DATA9
LCD_DATA10: C156.1 IC11.64(VPB(7)) ; port LCD_DATA10
LCD_DATA11: C168.1 IC11.60(VPA(3)) ; port LCD_DATA11
LCD_DATA12: C167.1 IC11.59(VPA(4)) ; port LCD_DATA12
LCD_DATA13: C166.1 IC11.58(VPA(5)) ; port LCD_DATA13
LCD_DATA14: C165.1 IC11.57(VPA(6)) ; port LCD_DATA14
LCD_DATA15: C164.1 IC11.56(VPA(7)) ; port LCD_DATA15
LCD_DE: IC11.20(DE/FREF) R48.2 ; port LCD_DE
LCD_HSYNC: IC11.22(HSYNC/HREF) R47.2 ; port LCD_HSYNC
LCD_PCLK: IC11.4(PCLK) R45.2 ; port LCD_PCLK
LCD_VSYNC: IC11.21(VSYNC/VREF) R46.2 ; port LCD_VSYNC
LCDDE: R48.1 ; port LCDDE
LCDPCLK: R45.1 ; port LCDPCLK
LCDVHYNC: R47.1 ; port LCDHSYNC
LCDVSYNC: R46.1 ; port LCDVSYNC
SPI1_CS0: IC11.25(AP1) ; port SPI1_CS0
SPI1_D0: IC11.24(AP0) ; port SPI1_D0
SPI1_SCLK: IC11.23(ACLK) ; port SPI1_SCLK
NetIC11_49: IC11.49(TEST) R149.1

Not connected (* = marked no-connect by the designer): IC11 26(AP2)* 28(AP4)*; XB6 2(HEC)*

### Layout directives
differential pair: HDMI_TX0_N, HDMI_TX0_P, HDMI_TX1_N, HDMI_TX1_P, HDMI_TX2_N, HDMI_TX2_P, HDMI_TXC_N, HDMI_TXC_P

### Notes on the sheet
- RED
- GREEN
- BLUE
- McASP0_ACLKX (Pin A13 Mode 0)
- McASP0_FSX  (Pin B13 Mode 0)
- McASP0_AXR2 (Pin C12 Mode 2)
- Date
- Name
- REV.:
- editor:
- CAD:
- - SL (3)
- sheet:
- LK :
- checked:
- of:
- (in symbol ICTDA19988, part A) Data IN; TMDS OUT; R; G; B; Audio; I2C

### Library data of the parts
C144 C146 C148 C151 = C2.2uF/6V3_02: Capacitor 0402;  6V3;  X5R; Value: 2.2uF/6V3_02
C145 C147 C149 C150 = C0.1uF/16V_02: Capacitor 0402 16V Y5V; Value: 0.1uF/16V_02
C156 C157 C160-C173 = C47pF/16V_02: Capacitor 0402;  16V;  X7R; Value: 47pF/16V_02
D8 = DRB751V40: DIODE SCHOTTKY 40V 120MA SOD323; Hersteller: NXP Semiconductors; Value: RB751V40; Bestellbezeichnung: RB751V40
DA6 = DATPD4EUSB30_NP: Diode Array TVS,  for USB3.0; 4fach, N und P getauscht; Bestellbezeichnung1: TPD4EUSB30DQAR; Bestellbezeichnung: IP4283CZ10-TBA; Value: TPD4EUSB30_NP
DA7 = DATPD4EUSB30_NP: Diode Array TVS,  for USB3.0; 4fach, N und P getauscht; Hersteller: TI, NXP; Bestellbezeichnung1: TPD4EUSB30DQAR; Bestellbezeichnung: IP4283CZ10-TBA; Value: TPD4EUSB30_NP
IC11 = ICTDA19988: DP to HDMI ESD, Level Shifter; Hersteller: NXP; Bestellbezeichnung: TDA19988BHN/C1; Value: TDA19988
L3 = L150 Ohm Ferrite: as L7 on sheet P03_BCS1_USB, Serial, uSD; Value: 150L
R45 = R22R_02: Resistor 0402; Value: 22R_02
R46-R48 R149 = R0R_02: Resistor 0402; Value: 0R_02
R146-R148 R158 = R10k_02: Resistor 0402; Value: 10k_02
R166 = R26k7_02: Resistor 0402; Value: 26k7_02
RT1 = RTFUSE0.1A/30V: resettable Fuse MF_MSMF 30V, 0,2A bei 23°C; Hersteller: BOURNS; Bestellbezeichnung: MF-MSMF010; Value: MF-MSMF010
XB6 = XBU_Micro-HDMI_Buchse_Type D: micro HDMI Buchse SMT Type D; Hersteller: fci; Bestellbezeichnung: 10118241-001RLF; Value: Micro-HDMI_Buchse_Type D

## Sheet P07_BCS1_Exp Conn.SchDoc
size A3; Date: 24.11.2011; CheckedBy: Finke; Author: Mierau; DrawnBy: Mierau; SheetNumber: 1; SheetTotal: 8; Anlage: 78; Beschreibung: Qseven; Kunde: 56; ProjektName: BCS1; ProjektNummer: 88xxx; Ersatz_fuer: 12; ersetzt_durch: 34; LKNummer: 6190202; ID_Nummer: 90
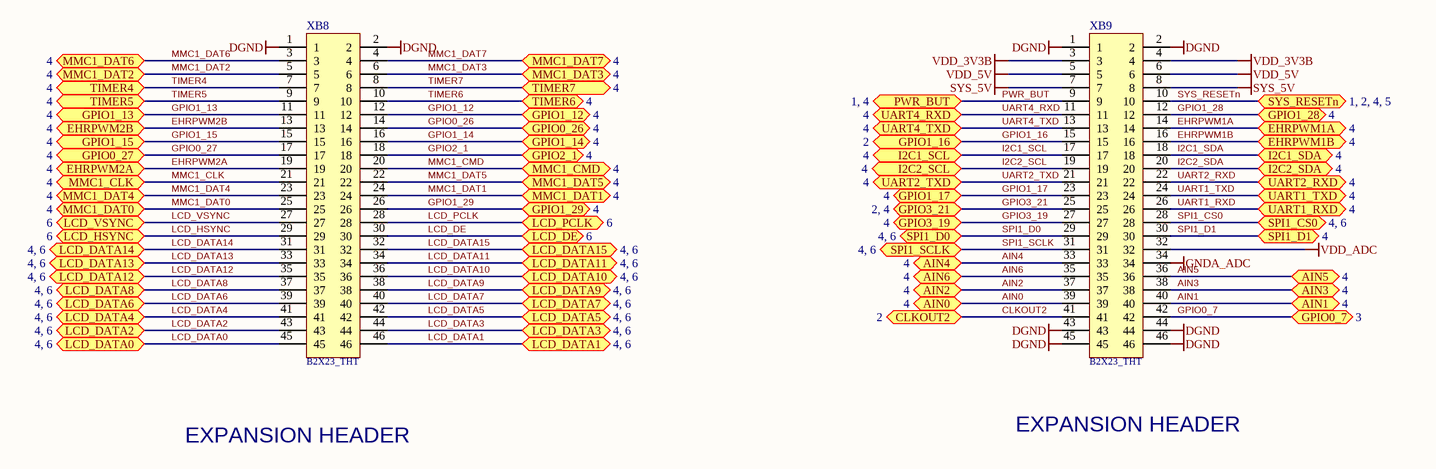
[diagram p6: P07_BCS1_Exp Conn.SchDoc]

### Parts
XB8  B2X23_THT  [BU2X23]
XB9  B2X23_THT  [BU2X23]

### Ports
AIN0 (see 4), AIN1 (see 4), AIN2 (see 4), AIN3 (see 4), AIN4 (see 4), AIN5 (see 4), AIN6 (see 4), CLKOUT2 (see 2), EHRPWM1A (see 4), EHRPWM1B (see 4), EHRPWM2A (see 4), EHRPWM2B (see 4), GPIO0_7 (see 3), GPIO0_26 (see 4), GPIO0_27 (see 4), GPIO1_12 (see 4), GPIO1_13 (see 4), GPIO1_14 (see 4), GPIO1_15 (see 4), GPIO1_16 (see 2), GPIO1_17 (see 4), GPIO1_28 (see 4), GPIO1_29 (see 4), GPIO2_1 (see 4), GPIO3_19 (see 4), GPIO3_21 (see 2, 4), I2C1_SCL (see 4), I2C1_SDA (see 4), I2C2_SCL (see 4), I2C2_SDA (see 4), LCD_DATA0 (see 4, 6), LCD_DATA1 (see 4, 6), LCD_DATA2 (see 4, 6), LCD_DATA3 (see 4, 6), LCD_DATA4 (see 4, 6), LCD_DATA5 (see 4, 6), LCD_DATA6 (see 4, 6), LCD_DATA7 (see 4, 6), LCD_DATA8 (see 4, 6), LCD_DATA9 (see 4, 6), LCD_DATA10 (see 4, 6), LCD_DATA11 (see 4, 6), LCD_DATA12 (see 4, 6), LCD_DATA13 (see 4, 6), LCD_DATA14 (see 4, 6), LCD_DATA15 (see 4, 6), LCD_DE (see 6), LCD_HSYNC (see 6), LCD_PCLK (see 6), LCD_VSYNC (see 6), MMC1_CLK (see 4), MMC1_CMD (see 4), MMC1_DAT0 (see 4), MMC1_DAT1 (see 4), MMC1_DAT2 (see 4), MMC1_DAT3 (see 4), MMC1_DAT4 (see 4), MMC1_DAT5 (see 4), MMC1_DAT6 (see 4), MMC1_DAT7 (see 4), PWR_BUT (see 1, 4), SPI1_CS0 (see 4, 6), SPI1_D0 (see 4, 6), SPI1_D1 (see 4), SPI1_SCLK (see 4, 6), SYS_RESETn (see 1, 2, 4, 5), TIMER4 (see 4), TIMER5 (see 4), TIMER6 (see 4), TIMER7 (see 4), UART1_RXD (see 4), UART1_TXD (see 4), UART2_RXD (see 4), UART2_TXD (see 4), UART4_RXD (see 4), UART4_TXD (see 4)

### Nets
DGND: XB8.1 XB8.2 XB9.1 XB9.2 XB9.43 XB9.44 XB9.45 XB9.46
GNDA_ADC: XB9.34
SYS_5V: XB9.7 XB9.8
VDD_3V3B: XB9.3 XB9.4
VDD_5V: XB9.5 XB9.6
VDD_ADC: XB9.32
AIN0: XB9.39 ; port AIN0
AIN1: XB9.40 ; port AIN1
AIN2: XB9.37 ; port AIN2
AIN3: XB9.38 ; port AIN3
AIN4: XB9.33 ; port AIN4
AIN5: XB9.36 ; port AIN5
AIN6: XB9.35 ; port AIN6
CLKOUT2: XB9.41 ; port CLKOUT2
EHRPWM1A: XB9.14 ; port EHRPWM1A
EHRPWM1B: XB9.16 ; port EHRPWM1B
EHRPWM2A: XB8.19 ; port EHRPWM2A
EHRPWM2B: XB8.13 ; port EHRPWM2B
GPIO0_7: XB9.42 ; port GPIO0_7
GPIO0_26: XB8.14 ; port GPIO0_26
GPIO0_27: XB8.17 ; port GPIO0_27
GPIO1_12: XB8.12 ; port GPIO1_12
GPIO1_13: XB8.11 ; port GPIO1_13
GPIO1_14: XB8.16 ; port GPIO1_14
GPIO1_15: XB8.15 ; port GPIO1_15
GPIO1_16: XB9.15 ; port GPIO1_16
GPIO1_17: XB9.23 ; port GPIO1_17
GPIO1_28: XB9.12 ; port GPIO1_28
GPIO1_29: XB8.26 ; port GPIO1_29
GPIO2_1: XB8.18 ; port GPIO2_1
GPIO3_19: XB9.27 ; port GPIO3_19
GPIO3_21: XB9.25 ; port GPIO3_21
I2C1_SCL: XB9.17 ; port I2C1_SCL
I2C1_SDA: XB9.18 ; port I2C1_SDA
I2C2_SCL: XB9.19 ; port I2C2_SCL
I2C2_SDA: XB9.20 ; port I2C2_SDA
LCD_DATA0: XB8.45 ; port LCD_DATA0
LCD_DATA1: XB8.46 ; port LCD_DATA1
LCD_DATA2: XB8.43 ; port LCD_DATA2
LCD_DATA3: XB8.44 ; port LCD_DATA3
LCD_DATA4: XB8.41 ; port LCD_DATA4
LCD_DATA5: XB8.42 ; port LCD_DATA5
LCD_DATA6: XB8.39 ; port LCD_DATA6
LCD_DATA7: XB8.40 ; port LCD_DATA7
LCD_DATA8: XB8.37 ; port LCD_DATA8
LCD_DATA9: XB8.38 ; port LCD_DATA9
LCD_DATA10: XB8.36 ; port LCD_DATA10
LCD_DATA11: XB8.34 ; port LCD_DATA11
LCD_DATA12: XB8.35 ; port LCD_DATA12
LCD_DATA13: XB8.33 ; port LCD_DATA13
LCD_DATA14: XB8.31 ; port LCD_DATA14
LCD_DATA15: XB8.32 ; port LCD_DATA15
LCD_DE: XB8.30 ; port LCD_DE
LCD_HSYNC: XB8.29 ; port LCD_HSYNC
LCD_PCLK: XB8.28 ; port LCD_PCLK
LCD_VSYNC: XB8.27 ; port LCD_VSYNC
MMC1_CLK: XB8.21 ; port MMC1_CLK
MMC1_CMD: XB8.20 ; port MMC1_CMD
MMC1_DAT0: XB8.25 ; port MMC1_DAT0
MMC1_DAT1: XB8.24 ; port MMC1_DAT1
MMC1_DAT2: XB8.5 ; port MMC1_DAT2
MMC1_DAT3: XB8.6 ; port MMC1_DAT3
MMC1_DAT4: XB8.23 ; port MMC1_DAT4
MMC1_DAT5: XB8.22 ; port MMC1_DAT5
MMC1_DAT6: XB8.3 ; port MMC1_DAT6
MMC1_DAT7: XB8.4 ; port MMC1_DAT7
PWR_BUT: XB9.9 ; port PWR_BUT
SPI1_CS0: XB9.28 ; port SPI1_CS0
SPI1_D0: XB9.29 ; port SPI1_D0
SPI1_D1: XB9.30 ; port SPI1_D1
SPI1_SCLK: XB9.31 ; port SPI1_SCLK
SYS_RESETn: XB9.10 ; port SYS_RESETn
TIMER4: XB8.7 ; port TIMER4
TIMER5: XB8.9 ; port TIMER5
TIMER6: XB8.10 ; port TIMER6
TIMER7: XB8.8 ; port TIMER7
UART1_RXD: XB9.26 ; port UART1_RXD
UART1_TXD: XB9.24 ; port UART1_TXD
UART2_RXD: XB9.22 ; port UART2_RXD
UART2_TXD: XB9.21 ; port UART2_TXD
UART4_RXD: XB9.11 ; port UART4_RXD
UART4_TXD: XB9.13 ; port UART4_TXD

### Notes on the sheet
- EXPANSION HEADER
- Date
- Name
- REV.:
- editor:
- CAD:
- - SL (3)
- sheet:
- LK :
- checked:
- of:

### Library data of the parts
XB8 XB9 = XB2X23_THT: Buchsenleiste 46pol. IDC, vertikal 2.54mm pitch; Hersteller: Sullins Connector Solutions; Bestellbezeichnung: PPPC232LFBN-RC; Value: B2X23_THT

## Sheet P08_BCS1_Revision Page.SchDoc
size A3; Date: 24.11.2011; CheckedBy: Finke; Author: Mierau; DrawnBy: Mierau; SheetNumber: 8; SheetTotal: 8; Anlage: 78; Beschreibung: Qseven; Kunde: 56; ProjektName: BCS1; ProjektNummer: 88xxx; Ersatz_fuer: 12; ersetzt_durch: 34; LKNummer: 6190202; ID_Nummer: 90
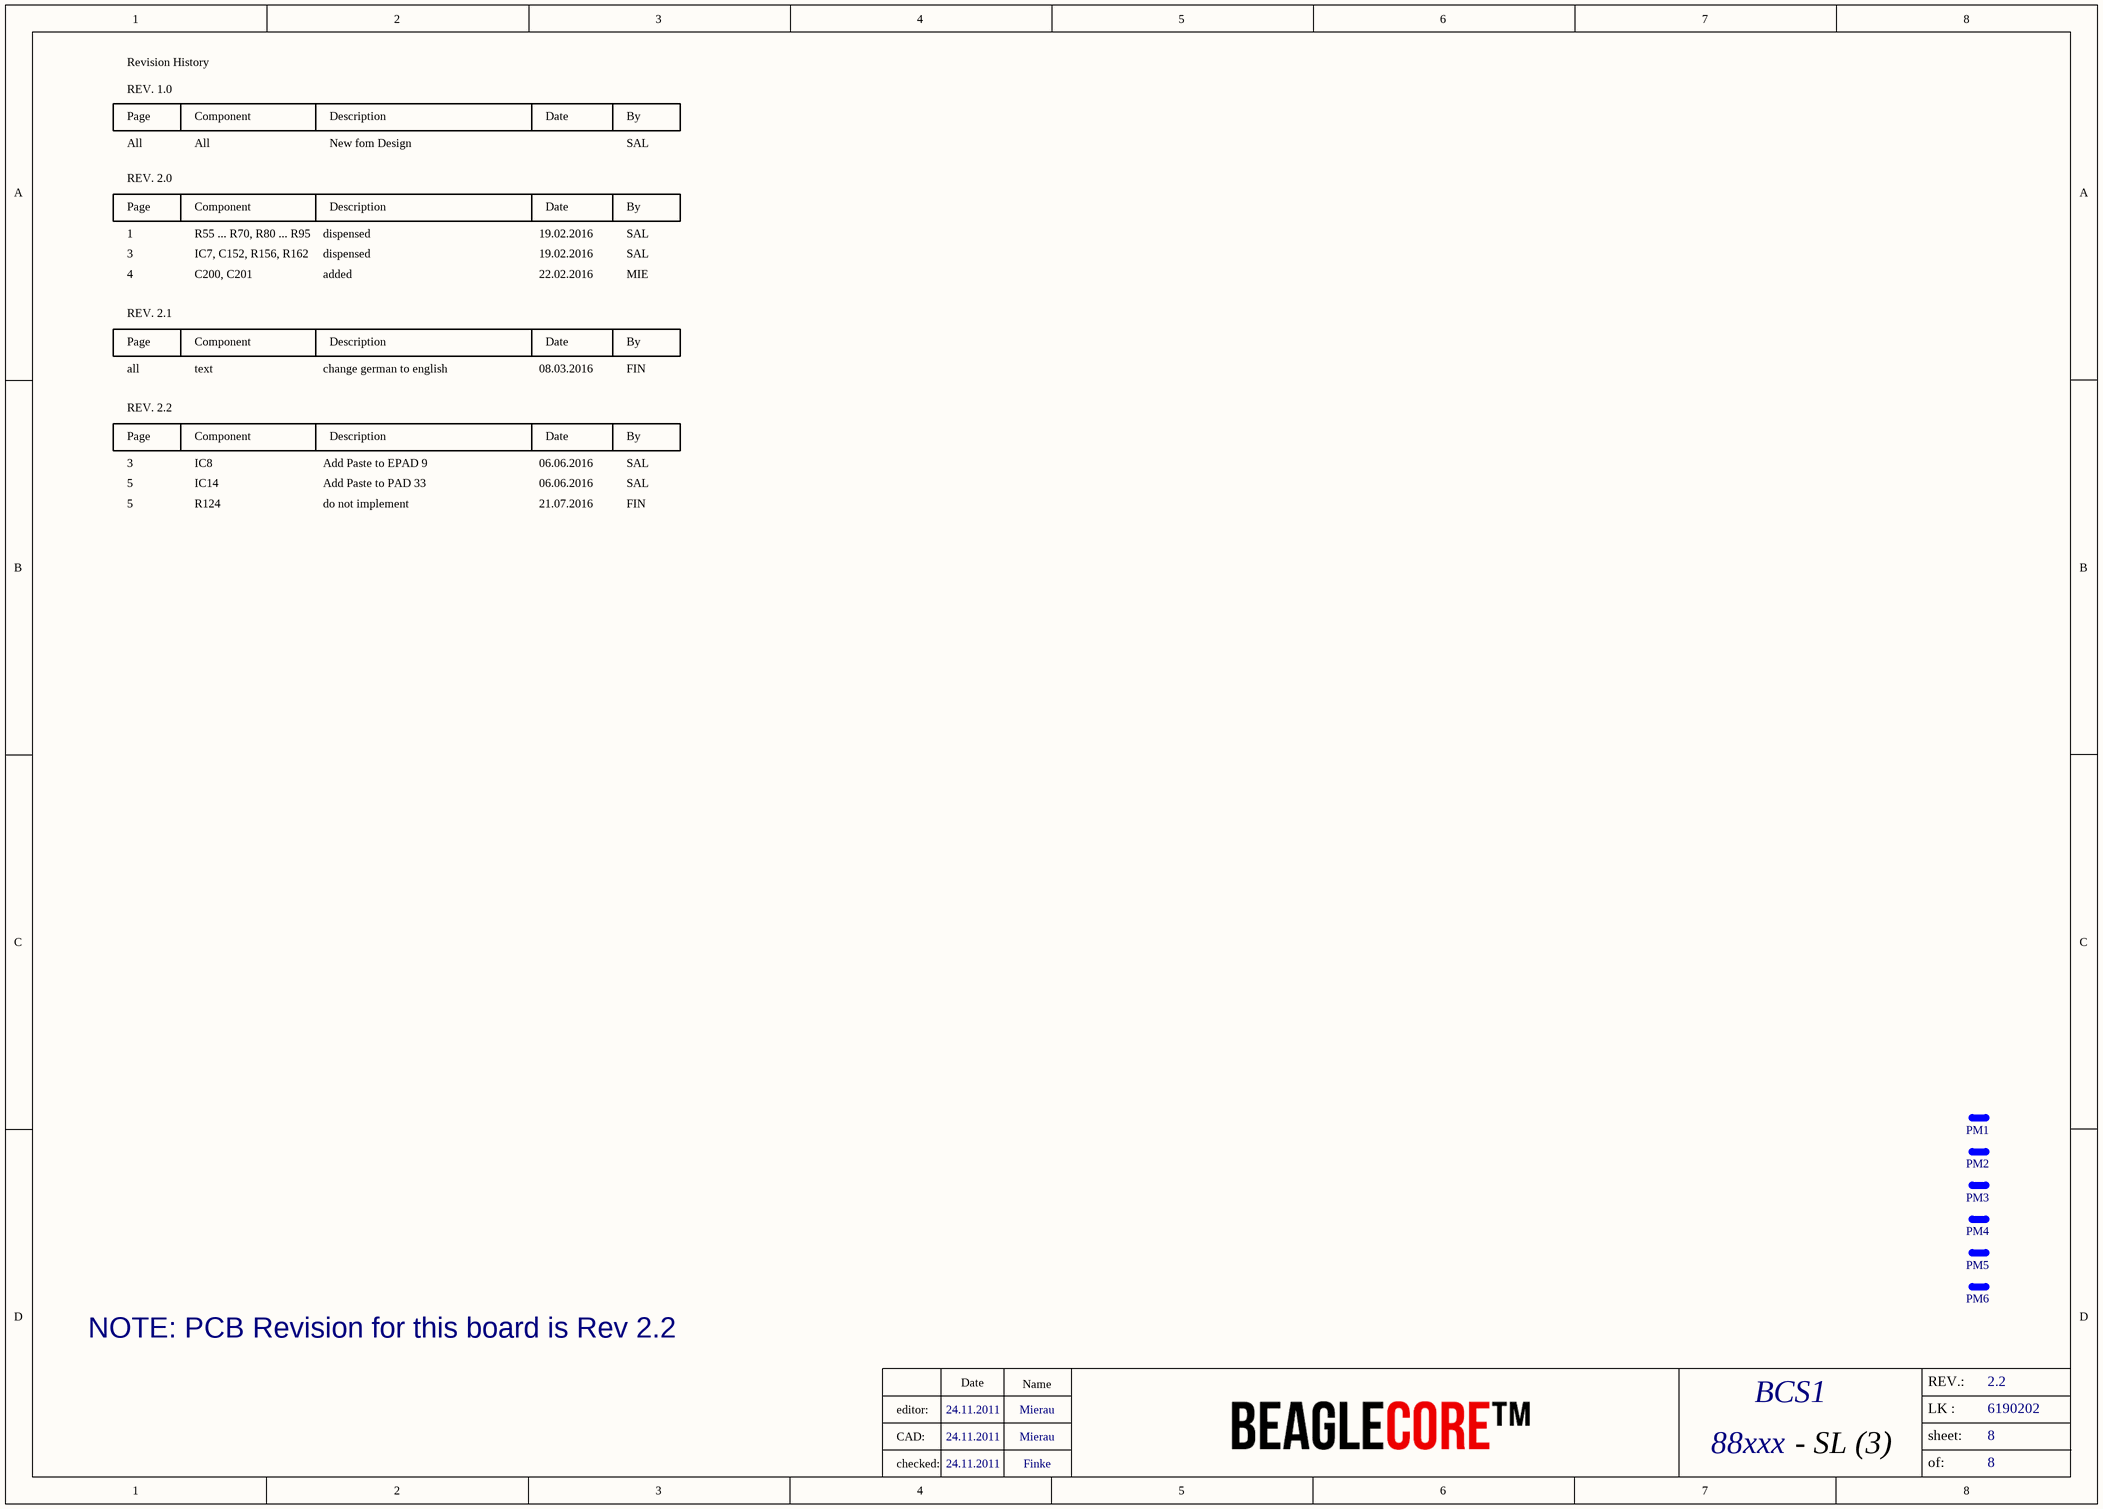
[diagram p7: P08_BCS1_Revision Page.SchDoc]

### Parts
PM1  PMR  [PASSER_RUND]  (value not drawn)
PM2  PMR  [PASSER_RUND]  (value not drawn)
PM3  PMR  [PASSER_RUND]  (value not drawn)
PM4  PMR  [PASSER_RUND]  (value not drawn)
PM5  PMR  [PASSER_RUND]  (value not drawn)
PM6  PMR  [PASSER_RUND]  (value not drawn)

### Notes on the sheet
- Revision History
- REV. 1.0
- Page
- All
- REV. 2.0
- Component
- Description
- New fom Design
- Date
- By
- SAL
- 1
- R55 ... R70, R80 ... R95
- dispensed
- 19.02.2016
- 3
- 4
- REV. 2.1
- IC7, C152, R156, R162
- C200, C201
- added
- 22.02.2016
- MIE
- all
- text
- change german to english
- 08.03.2016
- FIN
- REV. 2.2
- 5
- IC14
- IC8
- R124
- Add Paste to PAD 33
- Add Paste to EPAD 9
- do not implement
- 06.06.2016
- 21.07.2016
- NOTE: PCB Revision for this board is Rev 2.2
- Name
- REV.:
- editor:
- CAD:
- - SL (3)
- sheet:
- LK :
- checked:
- of:

### Library data of the parts
PM1-PM6 = A_PMR: Passer Markierung rund; Value: PMR